# EAGLE schematic hodiny2_4beta (EAGLE 5.11)

## Sheet 1 of 2
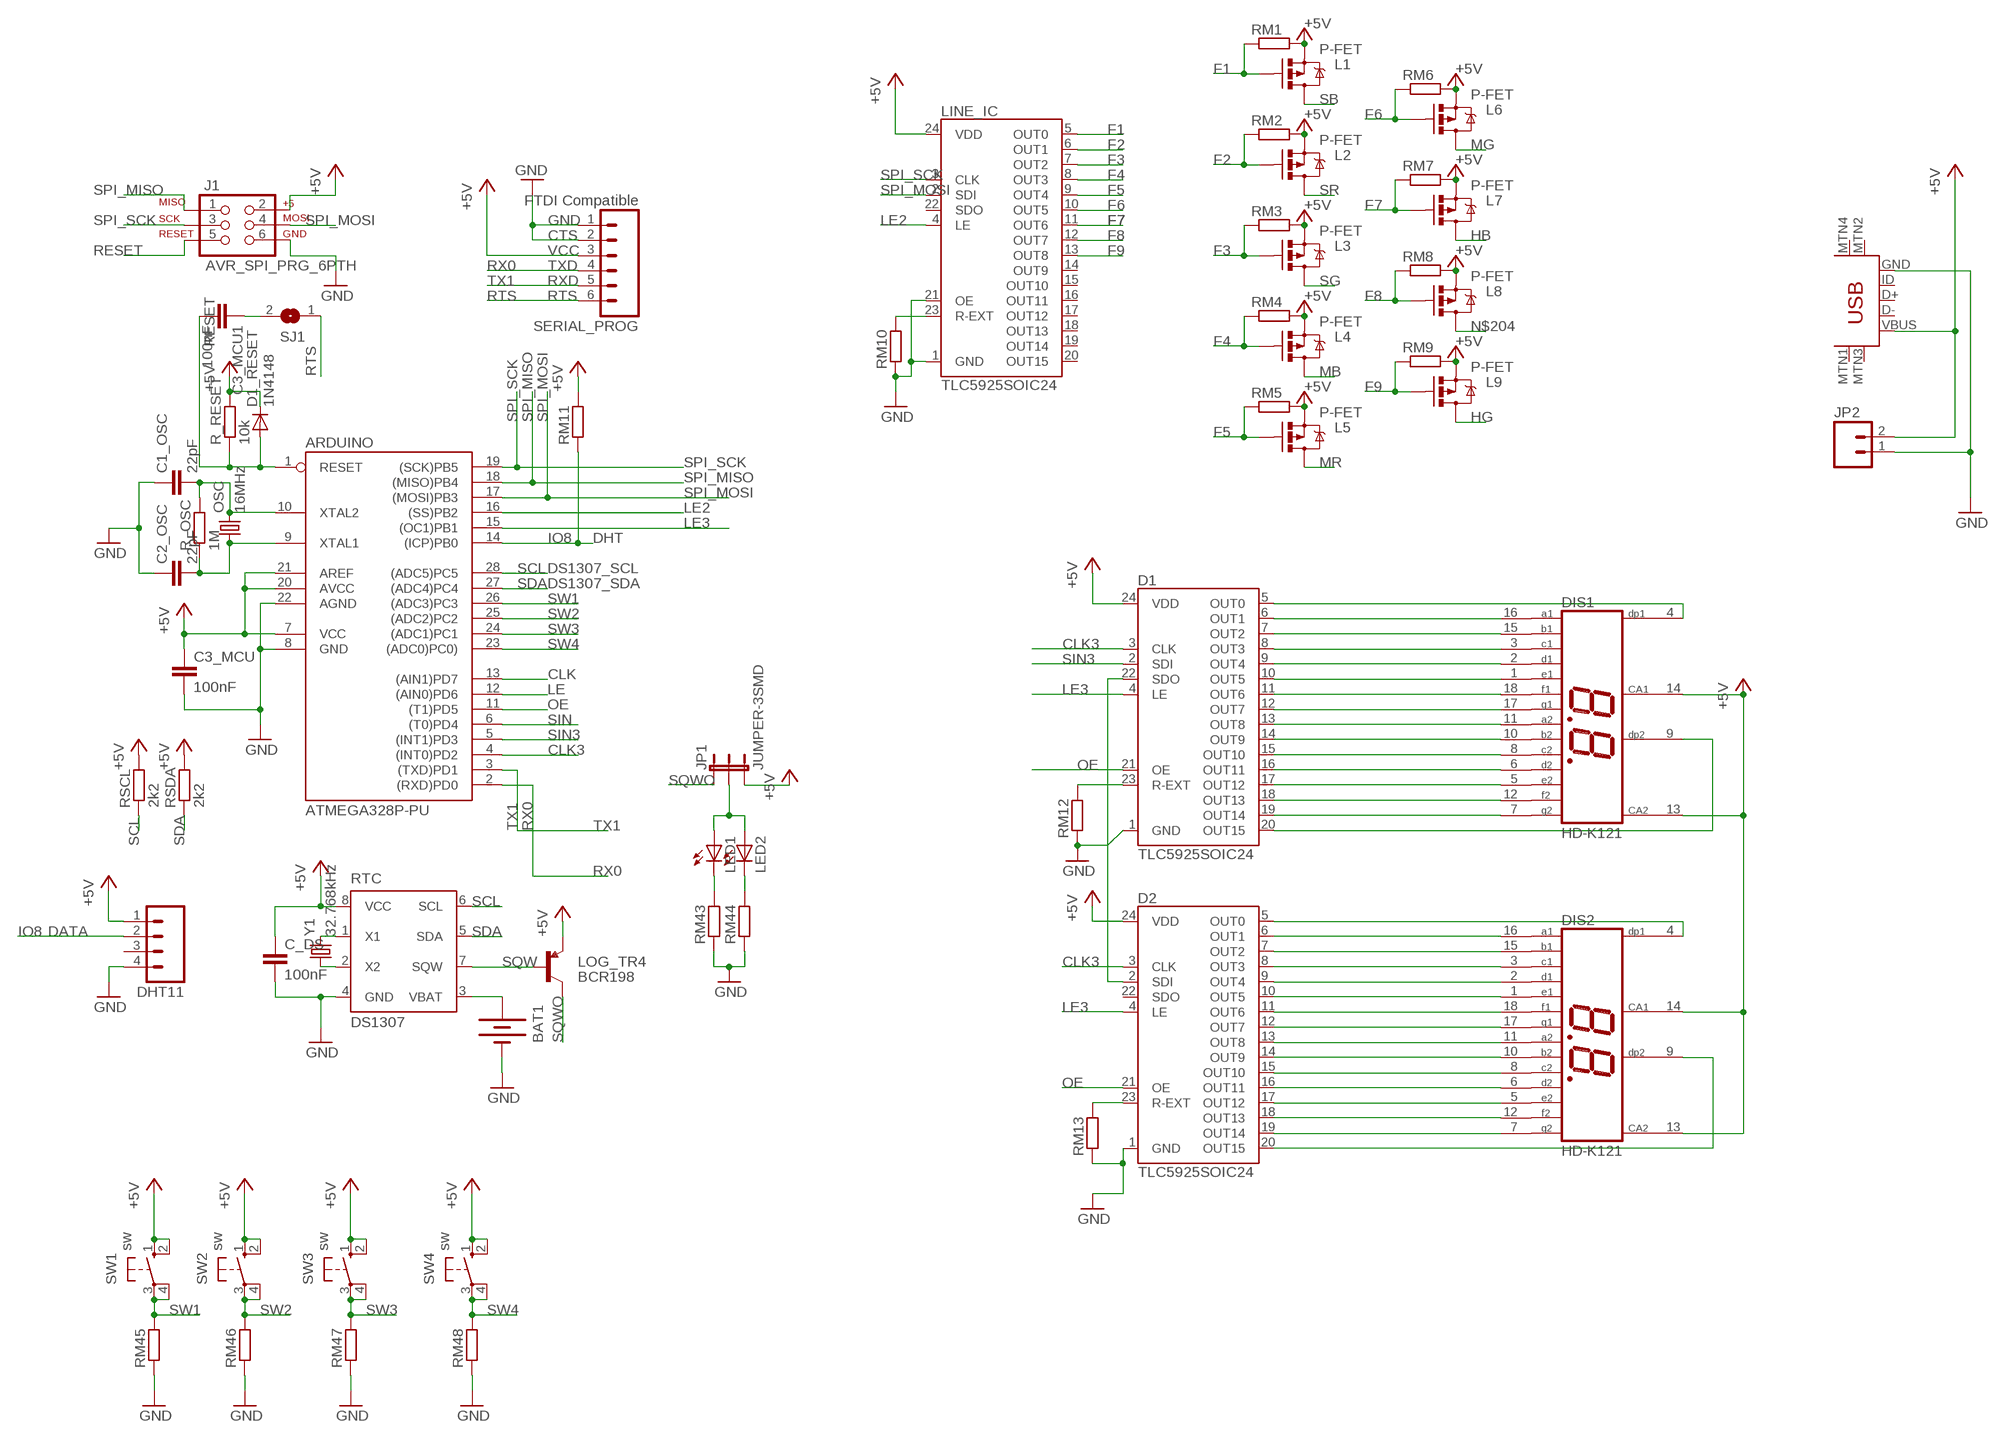
[diagram p0: schematic, sheet 1]

### Parts
ARDUINO  ATMEGA328P-PU  SMARTPRJ_ATMEGA328P-PU  [SMARTPRJ_DIL28-3]
BAT1  BATTERY12PTH  [BATTCON_12MM_PTH]
C1_OSC  22pF  CAP0603-CAP  [0603-CAP]
C2_OSC  22pF  CAP0603-CAP  [0603-CAP]
C3_MCU  100nF  C-EUC0805  [C0805]
C3_MCU1  100nF  C-EUC0805  [C0805]
C_DS  100nF  C-EUC0805  [C0805]
D1  TLC5925SOIC24  [SO24W]
D1_RESET  1N4148  1N4148DO35-7  [DO35-7]
D2  TLC5925SOIC24  [SO24W]
DHT11  M04PTH  [1X04]
DIS1  HD-K121  [HDSP-R]
DIS2  HD-K121  [HDSP-R]
J1  AVR_SPI_PRG_6PTH  [2X3]
JP1  JUMPER-3SMD  [SJ_3]
JP2  M025MM  [SCREWTERMINAL-5MM-2]
L1  P-FET  MOSFET-PCHANNELSMD  [SOT23-3]
L2  P-FET  MOSFET-PCHANNELSMD  [SOT23-3]
L3  P-FET  MOSFET-PCHANNELSMD  [SOT23-3]
L4  P-FET  MOSFET-PCHANNELSMD  [SOT23-3]
L5  P-FET  MOSFET-PCHANNELSMD  [SOT23-3]
L6  P-FET  MOSFET-PCHANNELSMD  [SOT23-3]
L7  P-FET  MOSFET-PCHANNELSMD  [SOT23-3]
L8  P-FET  MOSFET-PCHANNELSMD  [SOT23-3]
L9  P-FET  MOSFET-PCHANNELSMD  [SOT23-3]
LED1  LED_LED3MM  [LED_LED3MM]
LED2  LED_LED3MM  [LED_LED3MM]
LINE_IC  TLC5925SOIC24  [SO24W]
LOG_TR4  BCR198  TRANSISTOR_PNPSMD  [SOT23-3]
OSC  16MHz  CRYSTALHC49UP  [HC49UP]
R_OSC  1M  R-EU_0207/10  [0207/10]
R_RESET  10k  R-EU_0207/10  [0207/10]
RM1  R-EU_M0805  [M0805]
RM2  R-EU_M0805  [M0805]
RM3  R-EU_M0805  [M0805]
RM4  R-EU_M0805  [M0805]
RM5  R-EU_M0805  [M0805]
RM6  R-EU_M0805  [M0805]
RM7  R-EU_M0805  [M0805]
RM8  R-EU_M0805  [M0805]
RM9  R-EU_M0805  [M0805]
RM10  R-EU_M0805  [M0805]
RM11  R-EU_M0805  [M0805]
RM12  R-EU_M0805  [M0805]
RM13  R-EU_M0805  [M0805]
RM43  R-EU_M0805  [M0805]
RM44  R-EU_M0805  [M0805]
RM45  R-EU_M0805  [M0805]
RM46  R-EU_M0805  [M0805]
RM47  R-EU_M0805  [M0805]
RM48  R-EU_M0805  [M0805]
RSCL  2k2  SMARTPRJ_R-EU_M1206  [SMARTPRJ_M1206]
RSDA  2k2  SMARTPRJ_R-EU_M1206  [SMARTPRJ_M1206]
RTC  DS1307  [DIL08]
SERIAL_PROG  FTDI Compatible  M06LOCK  [1X06_LOCK]
SJ1  SJ  [SJ]
SW1  sw  11-XX  [B3F-11XX]
SW2  sw  11-XX  [B3F-11XX]
SW3  sw  11-XX  [B3F-11XX]
SW4  sw  11-XX  [B3F-11XX]
U$1  USB-MINIB-5PIN  [USB-MINIB]
Y1  32.768kHz  CRYSTALTC38H  [TC38H]

### Nets
+5V: ARDUINO.7(VCC) ARDUINO.20(AVCC) ARDUINO.21(AREF) C3_MCU.1 C_DS.1 D1.24(VDD) D1_RESET.C D2.24(VDD) DHT11.1 DIS1.13(CA2) DIS1.14(CA1) DIS2.13(CA2) DIS2.14(CA1) J1.2 JP1.3 JP2.2 L1.2(S) L2.2(S) L3.2(S) L4.2(S) L5.2(S) L6.2(S) L7.2(S) L8.2(S) L9.2(S) LINE_IC.24(VDD) LOG_TR4.2(E) R_RESET.2 RM1.2 RM2.2 RM3.2 RM4.2 RM5.2 RM6.2 RM7.2 RM8.2 RM9.2 RM11.2 RSCL.2 RSDA.2 RTC.8(VCC) SERIAL_PROG.3 SW1.1(S) SW1.2(S1) SW2.1(S) SW2.2(S1) SW3.1(S) SW3.2(S1) SW4.1(S) SW4.2(S1) U$1.VBUS ; also sheet 2
CLK: ARDUINO.13((AIN1)PD7) ; also sheet 2
CLK3: ARDUINO.4((INT0)PD2) D1.3(CLK) D2.3(CLK)
F1: L1.1(G) LINE_IC.5(OUT0) RM1.1
F2: L2.1(G) LINE_IC.6(OUT1) RM2.1
F3: L3.1(G) LINE_IC.7(OUT2) RM3.1
F4: L4.1(G) LINE_IC.8(OUT3) RM4.1
F5: L5.1(G) LINE_IC.9(OUT4) RM5.1
F6: L6.1(G) LINE_IC.10(OUT5) RM6.1
F7: L7.1(G) LINE_IC.11(OUT6) RM7.1
F8: L8.1(G) LINE_IC.12(OUT7) RM8.1
F9: L9.1(G) LINE_IC.13(OUT8) RM9.1
GND: ARDUINO.8(GND) ARDUINO.22(AGND) BAT1.GND(-) C1_OSC.1 C2_OSC.1 C3_MCU.2 C_DS.2 D1.1(GND) D2.1(GND) DHT11.4 J1.6 JP2.1 LINE_IC.1(GND) LINE_IC.21(OE) RM10.1 RM12.1 RM13.1 RM43.1 RM44.1 RM45.1 RM46.1 RM47.1 RM48.1 RTC.4(GND) SERIAL_PROG.1 SERIAL_PROG.2 U$1.GND ; also sheet 2
HB: L7.3(D) ; also sheet 2
HG: L9.3(D) ; also sheet 2
IO8: ARDUINO.14((ICP)PB0) DHT11.2 RM11.1
LE: ARDUINO.12((AIN0)PD6) ; also sheet 2
LE2: ARDUINO.16((SS)PB2) LINE_IC.4(LE)
LE3: ARDUINO.15((OC1)PB1) D1.4(LE) D2.4(LE)
MB: L4.3(D) ; also sheet 2
MG: L6.3(D) ; also sheet 2
MR: L5.3(D) ; also sheet 2
N$1: RTC.1(X1) Y1.2
N$2: RTC.2(X2) Y1.1
N$3: D1.5(OUT0) DIS1.4(DP1)
N$5: BAT1.VCC@1(+) RTC.3(VBAT)
N$11: ARDUINO.9(XTAL1) C2_OSC.2 OSC.1 R_OSC.1
N$13: ARDUINO.10(XTAL2) C1_OSC.2 OSC.2 R_OSC.2
N$14: C3_MCU1.1 SJ1.2
N$35: D1.20(OUT15) DIS1.9(DP2)
N$189: D1.19(OUT14) DIS1.7(G2)
N$190: D1.18(OUT13) DIS1.12(F2)
N$191: D1.17(OUT12) DIS1.5(E2)
N$192: D1.16(OUT11) DIS1.6(D2)
N$193: D1.15(OUT10) DIS1.8(C2)
N$194: D1.14(OUT9) DIS1.10(B2)
N$195: D1.13(OUT8) DIS1.11(A2)
N$196: D1.12(OUT7) DIS1.17(G1)
N$197: LINE_IC.23(R-EXT) RM10.2
N$198: D1.11(OUT6) DIS1.18(F1)
N$199: D1.10(OUT5) DIS1.1(E1)
N$200: D1.9(OUT4) DIS1.2(D1)
N$201: D1.8(OUT3) DIS1.3(C1)
N$202: D1.7(OUT2) DIS1.15(B1)
N$203: D1.6(OUT1) DIS1.16(A1)
N$204: L8.3(D) ; also sheet 2
N$205: D2.5(OUT0) DIS2.4(DP1)
N$206: D2.20(OUT15) DIS2.9(DP2)
N$207: D2.19(OUT14) DIS2.7(G2)
N$208: D2.18(OUT13) DIS2.12(F2)
N$209: D2.17(OUT12) DIS2.5(E2)
N$210: D2.16(OUT11) DIS2.6(D2)
N$211: D2.15(OUT10) DIS2.8(C2)
N$212: D2.14(OUT9) DIS2.10(B2)
N$213: D2.13(OUT8) DIS2.11(A2)
N$214: D2.12(OUT7) DIS2.17(G1)
N$215: D2.11(OUT6) DIS2.18(F1)
N$216: D2.10(OUT5) DIS2.1(E1)
N$217: D2.9(OUT4) DIS2.2(D1)
N$218: D2.8(OUT3) DIS2.3(C1)
N$219: D2.7(OUT2) DIS2.15(B1)
N$220: D2.6(OUT1) DIS2.16(A1)
N$221: D1.23(R-EXT) RM12.2
N$223: D2.23(R-EXT) RM13.2
N$225: D1.22(SDO) D2.2(SDI)
N$264: JP1.2 LED1.A LED2.A
N$265: LED1.K(C) RM43.2
N$266: LED2.K(C) RM44.2
OE: ARDUINO.11((T1)PD5) D1.21(OE) D2.21(OE) ; also sheet 2
RESET: ARDUINO.1(RESET) C3_MCU1.2 D1_RESET.A J1.5 R_RESET.1
RTS: SERIAL_PROG.6 SJ1.1
RX0: ARDUINO.2((RXD)PD0) SERIAL_PROG.4
SB: L1.3(D) ; also sheet 2
SCL: ARDUINO.28((ADC5)PC5) RSCL.1 RTC.6(SCL)
SDA: ARDUINO.27((ADC4)PC4) RSDA.1 RTC.5(SDA)
SG: L3.3(D) ; also sheet 2
SIN: ARDUINO.6((T0)PD4) ; also sheet 2
SIN3: ARDUINO.5((INT1)PD3) D1.2(SDI)
SPI_MISO: ARDUINO.18((MISO)PB4) J1.1
SPI_MOSI: ARDUINO.17((MOSI)PB3) J1.4 LINE_IC.2(SDI)
SPI_SCK: ARDUINO.19((SCK)PB5) J1.3 LINE_IC.3(CLK)
SQW: LOG_TR4.1(B) RTC.7(SQW)
SQWO: JP1.1 LOG_TR4.3(C)
SR: L2.3(D) ; also sheet 2
SW1: ARDUINO.26((ADC3)PC3) RM45.2 SW1.3(P) SW1.4(P1)
SW2: ARDUINO.25((ADC2)PC2) RM46.2 SW2.3(P) SW2.4(P1)
SW3: ARDUINO.24((ADC1)PC1) RM47.2 SW3.3(P) SW3.4(P1)
SW4: ARDUINO.23((ADC0)PC0)) RM48.2 SW4.3(P) SW4.4(P1)
TX1: ARDUINO.3((TXD)PD1) SERIAL_PROG.5
Unconnected: D2.22(SDO) DHT11.3 LINE_IC.14(OUT9) LINE_IC.15(OUT10) LINE_IC.16(OUT11) LINE_IC.17(OUT12) LINE_IC.18(OUT13) LINE_IC.19(OUT14) LINE_IC.20(OUT15) LINE_IC.22(SDO) U$1.D+ U$1.D- U$1.ID U$1.MTN1(MTN2) U$1.MTN2(MTN3) U$1.MTN3(MTN1) U$1.MTN4

### Notes on the sheet
- GND
- CTS
- VCC
- TXD
- RXD
- RTS
- DHT
- DS1307_SCL
- DS1307_SDA
- DATA

## Sheet 2 of 2
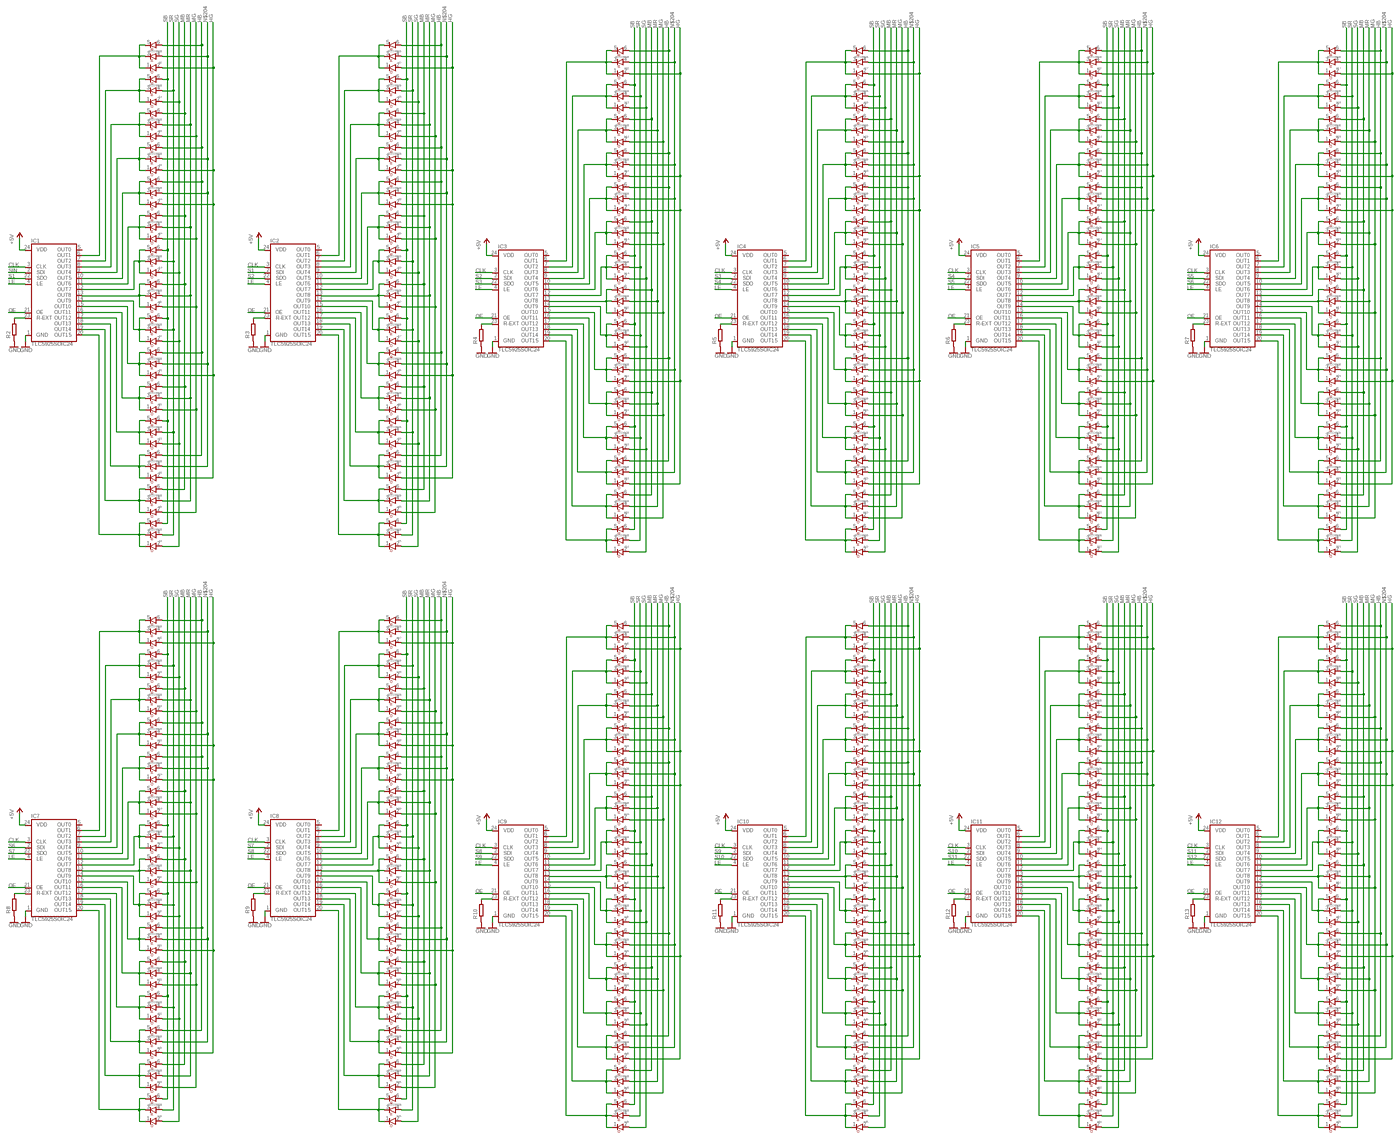
[diagram p1: schematic, sheet 2, overview]
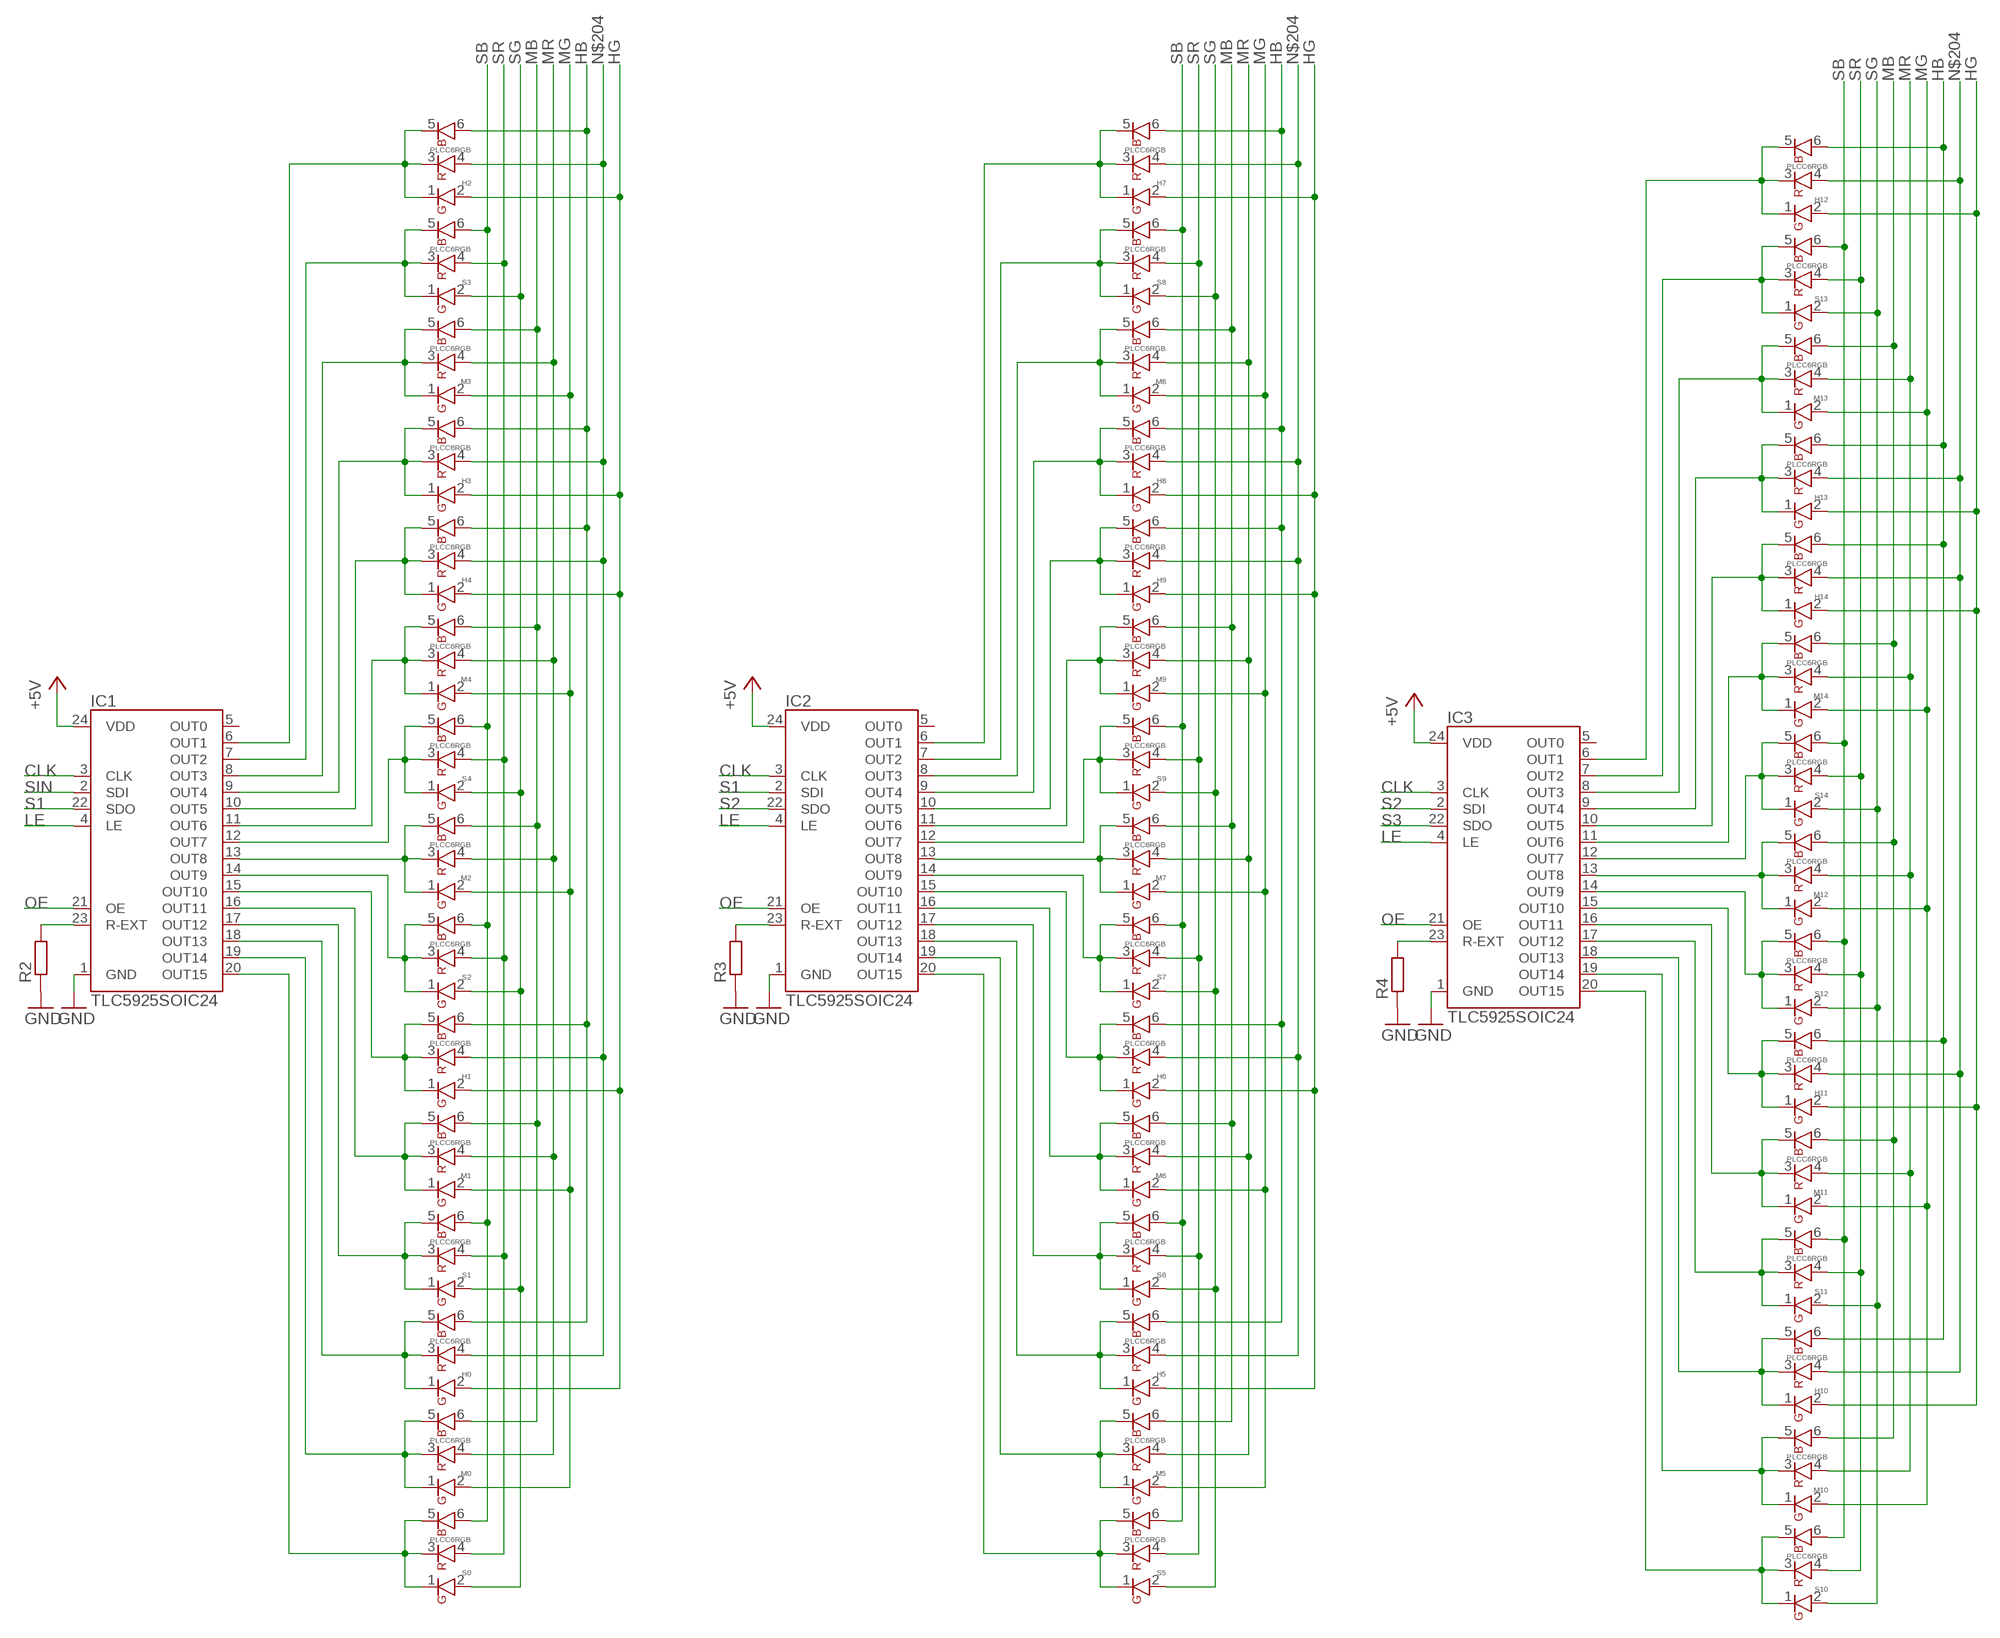
[diagram p2: schematic, sheet 2, part 1 of 4]
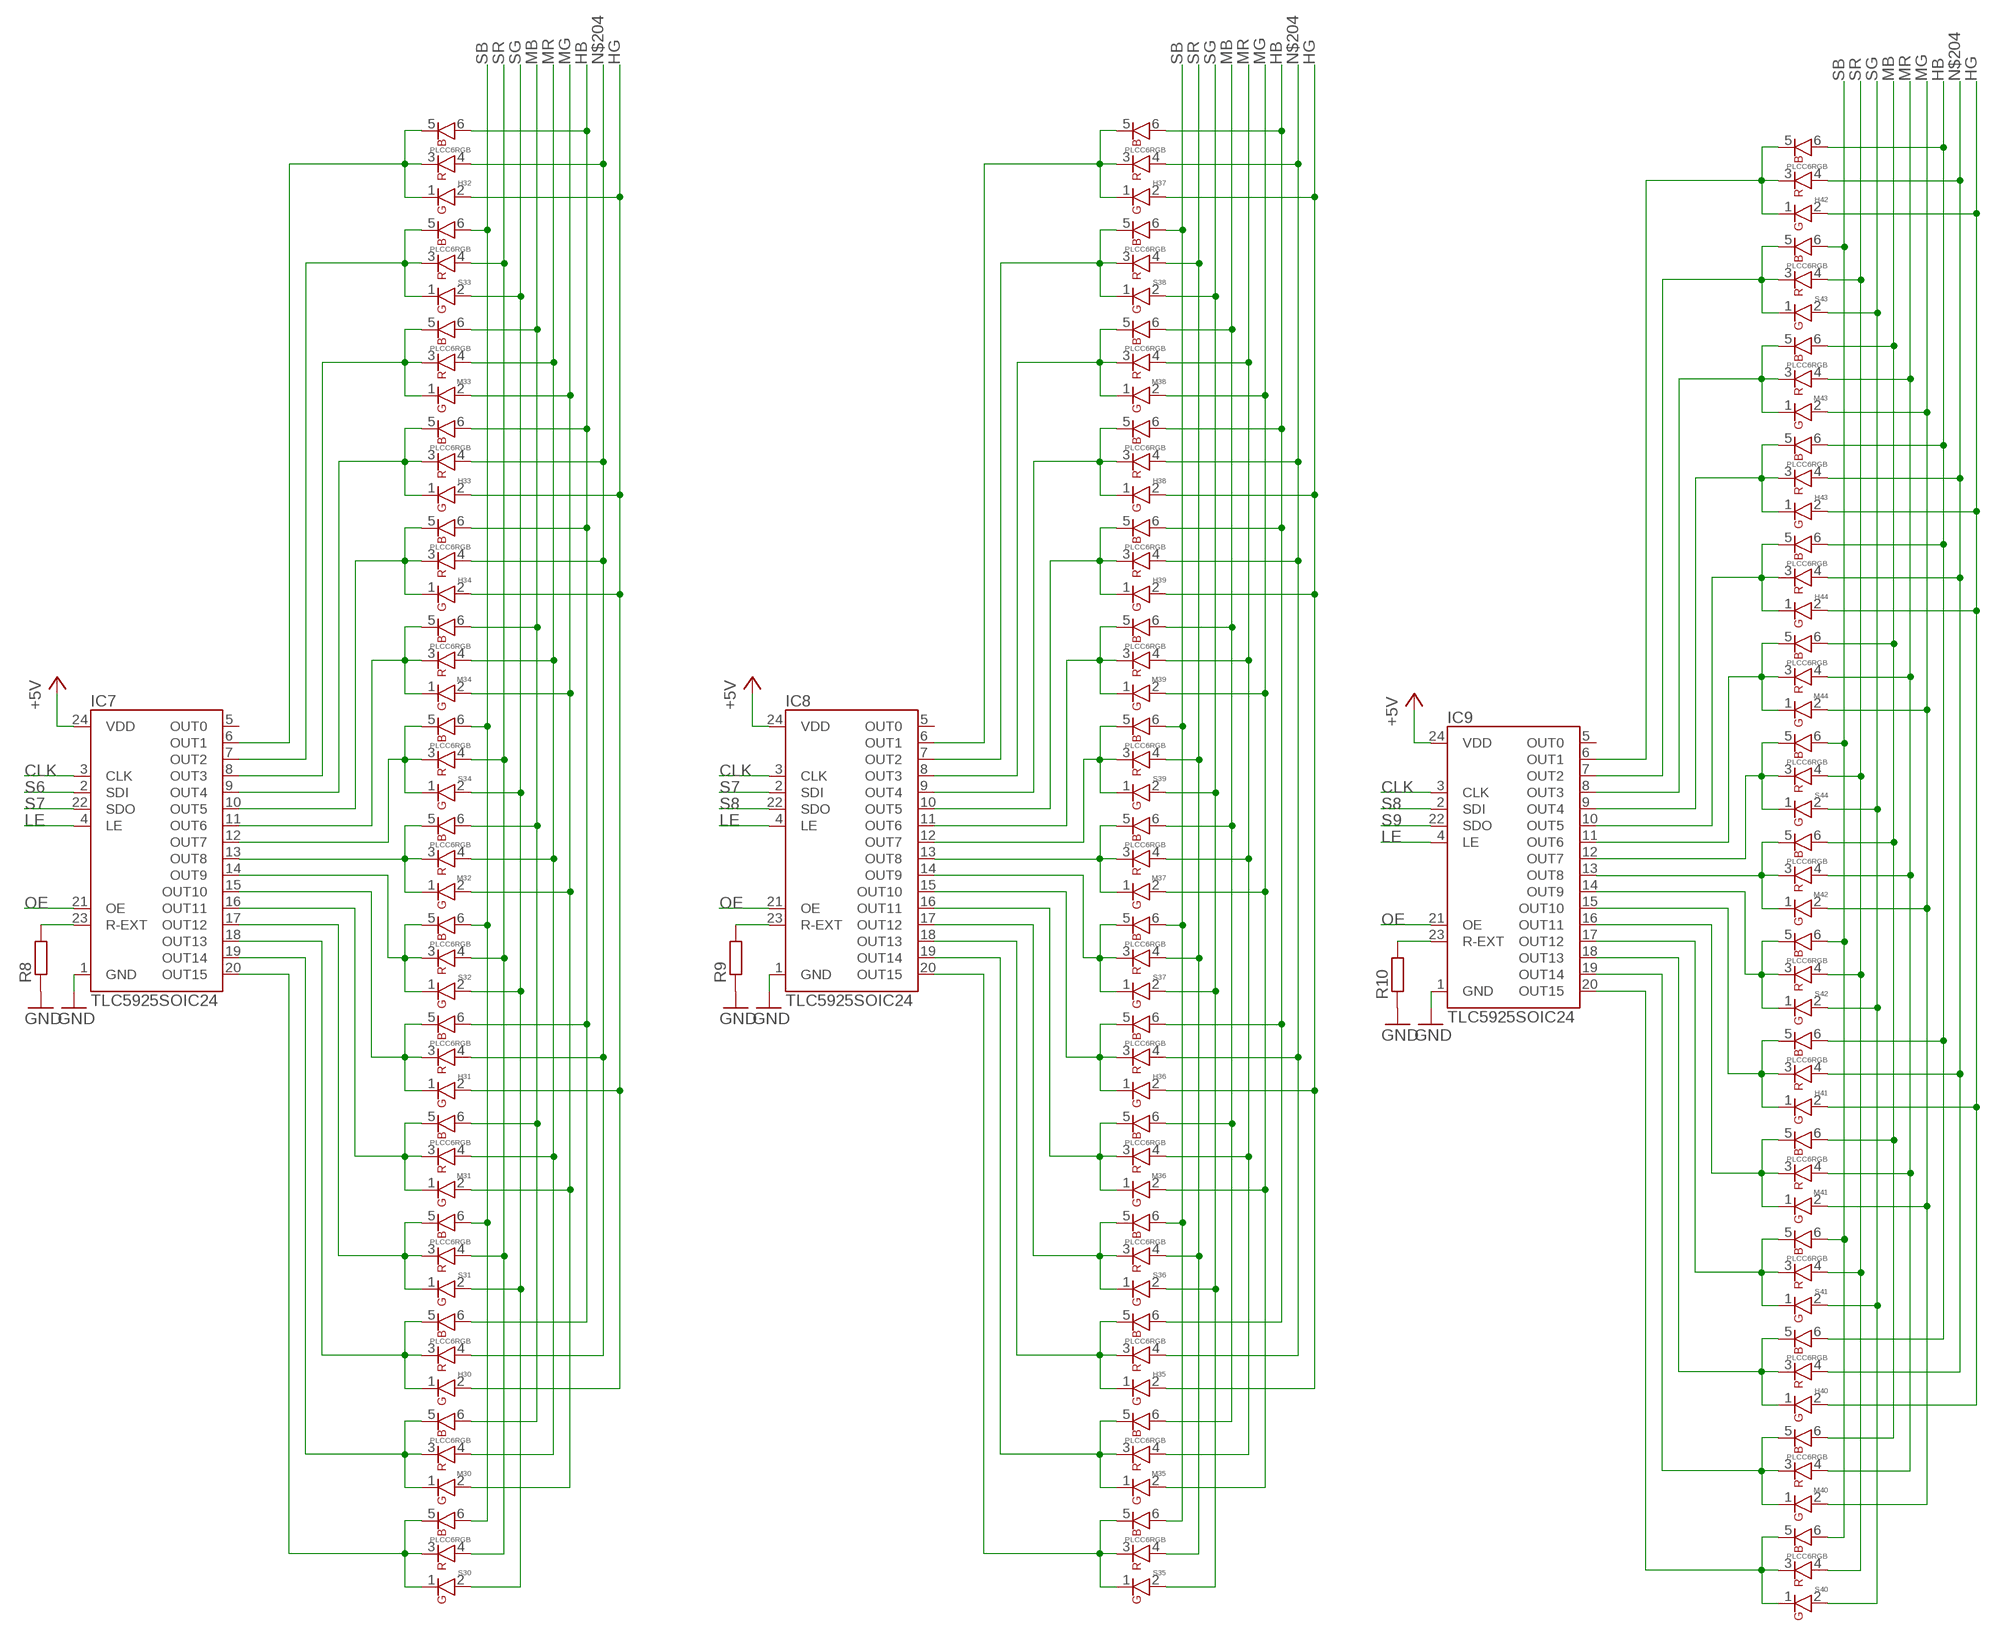
[diagram p3: schematic, sheet 2, part 2 of 4]
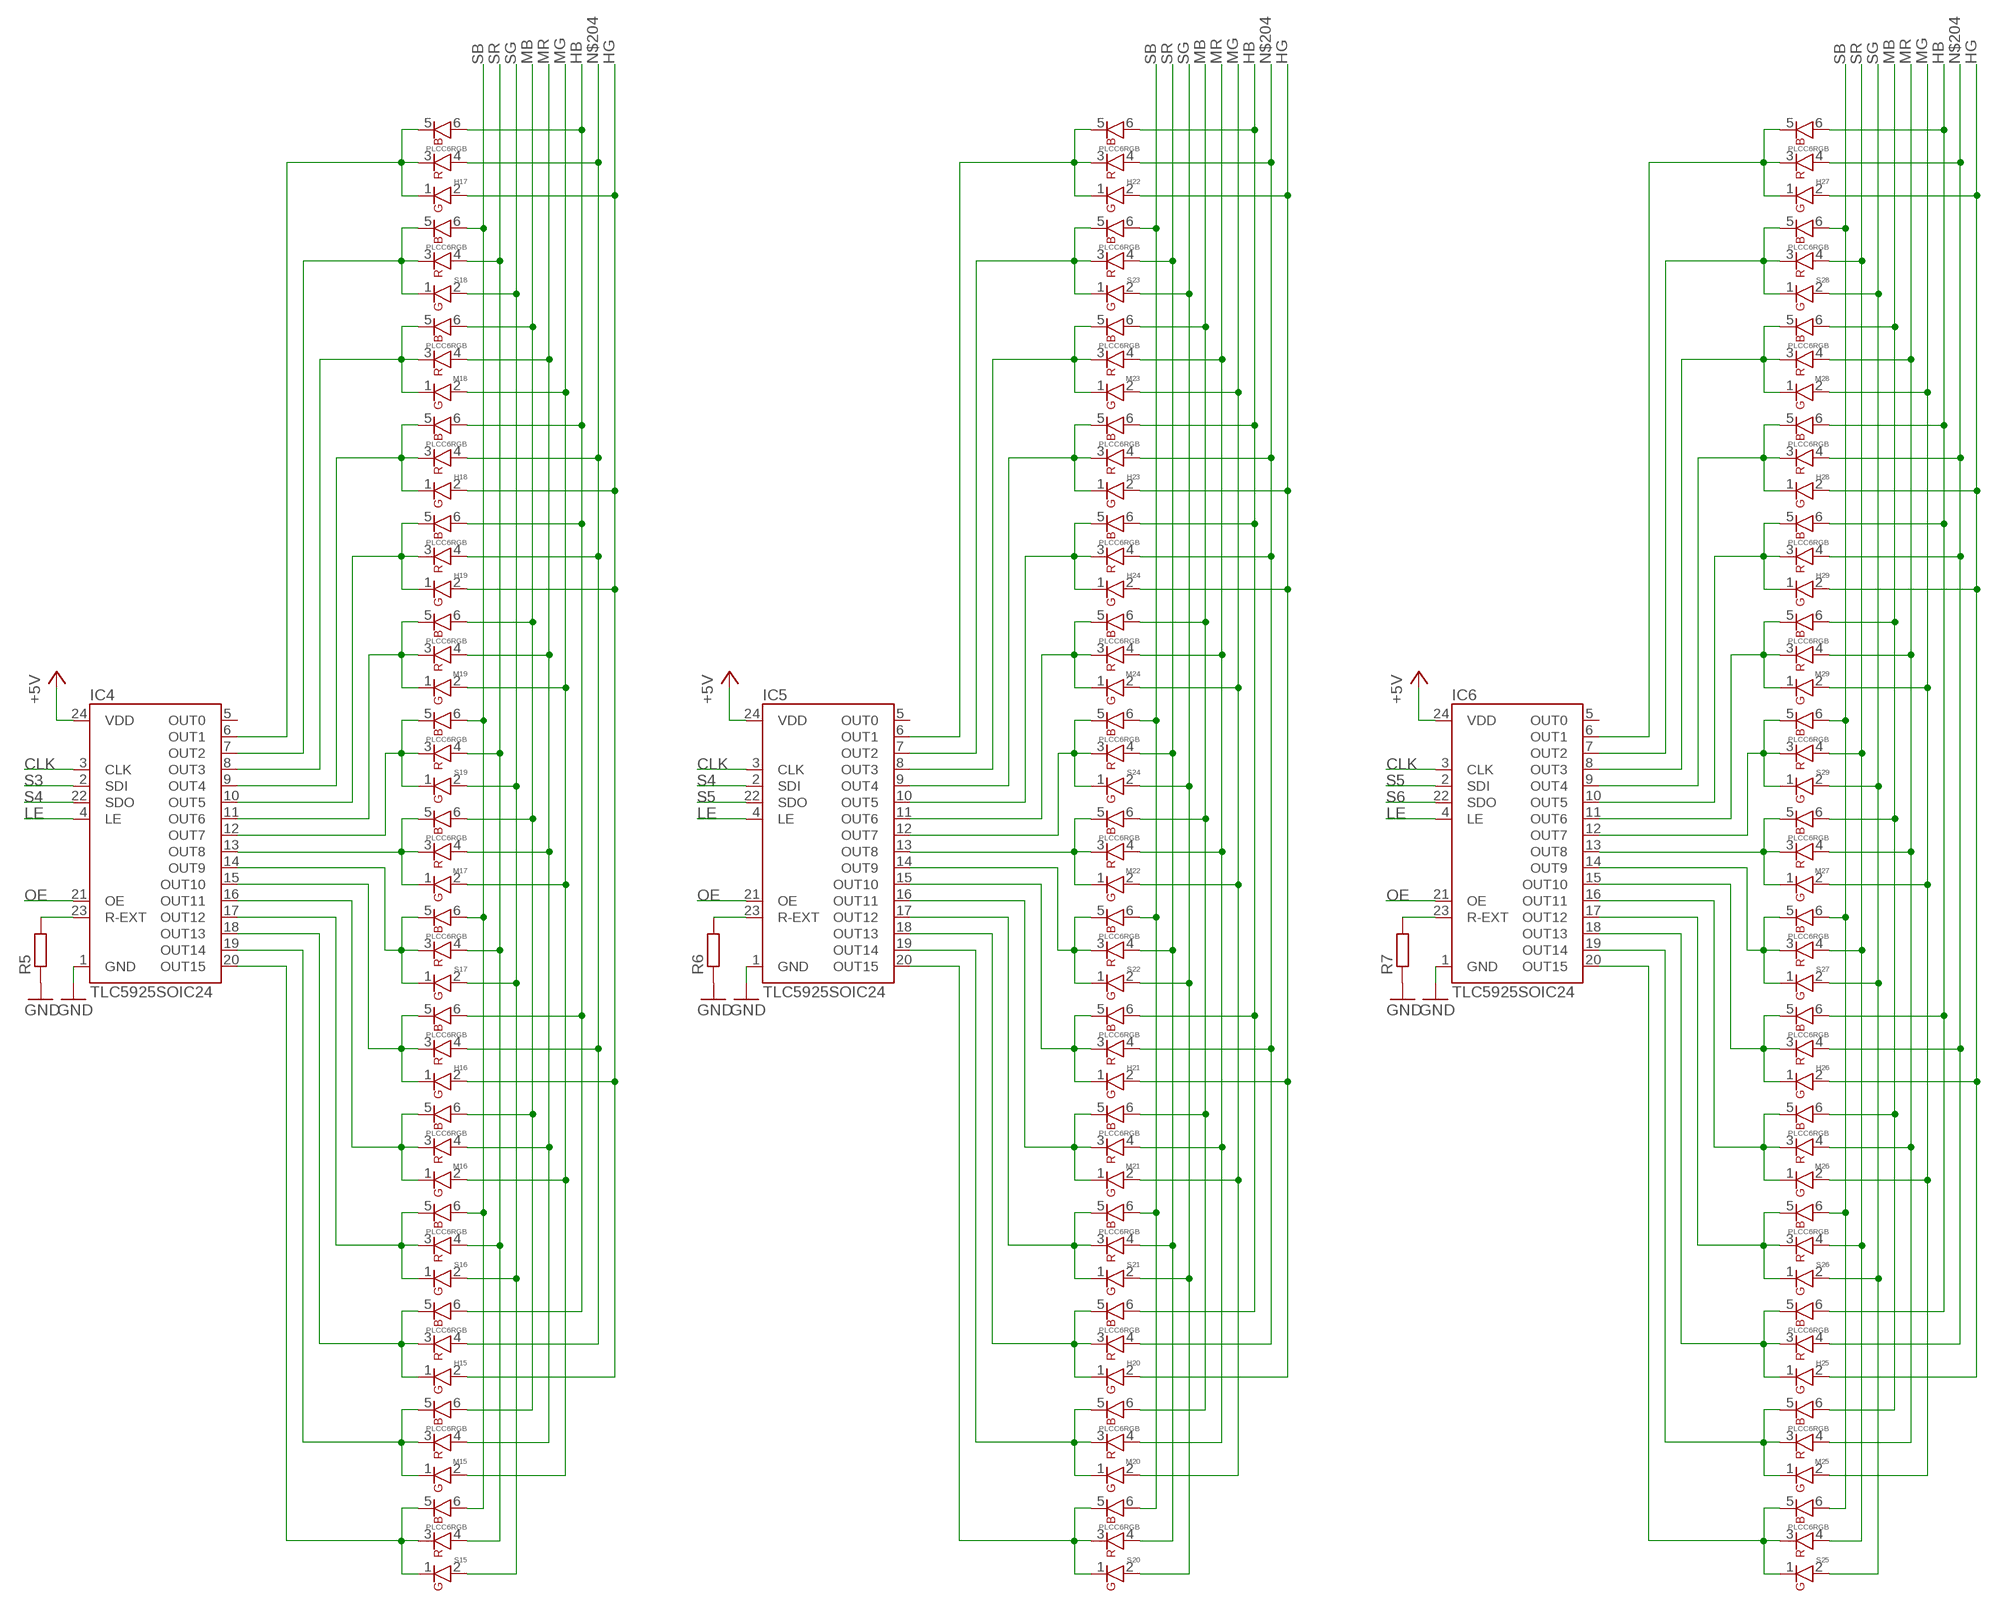
[diagram p4: schematic, sheet 2, part 3 of 4]
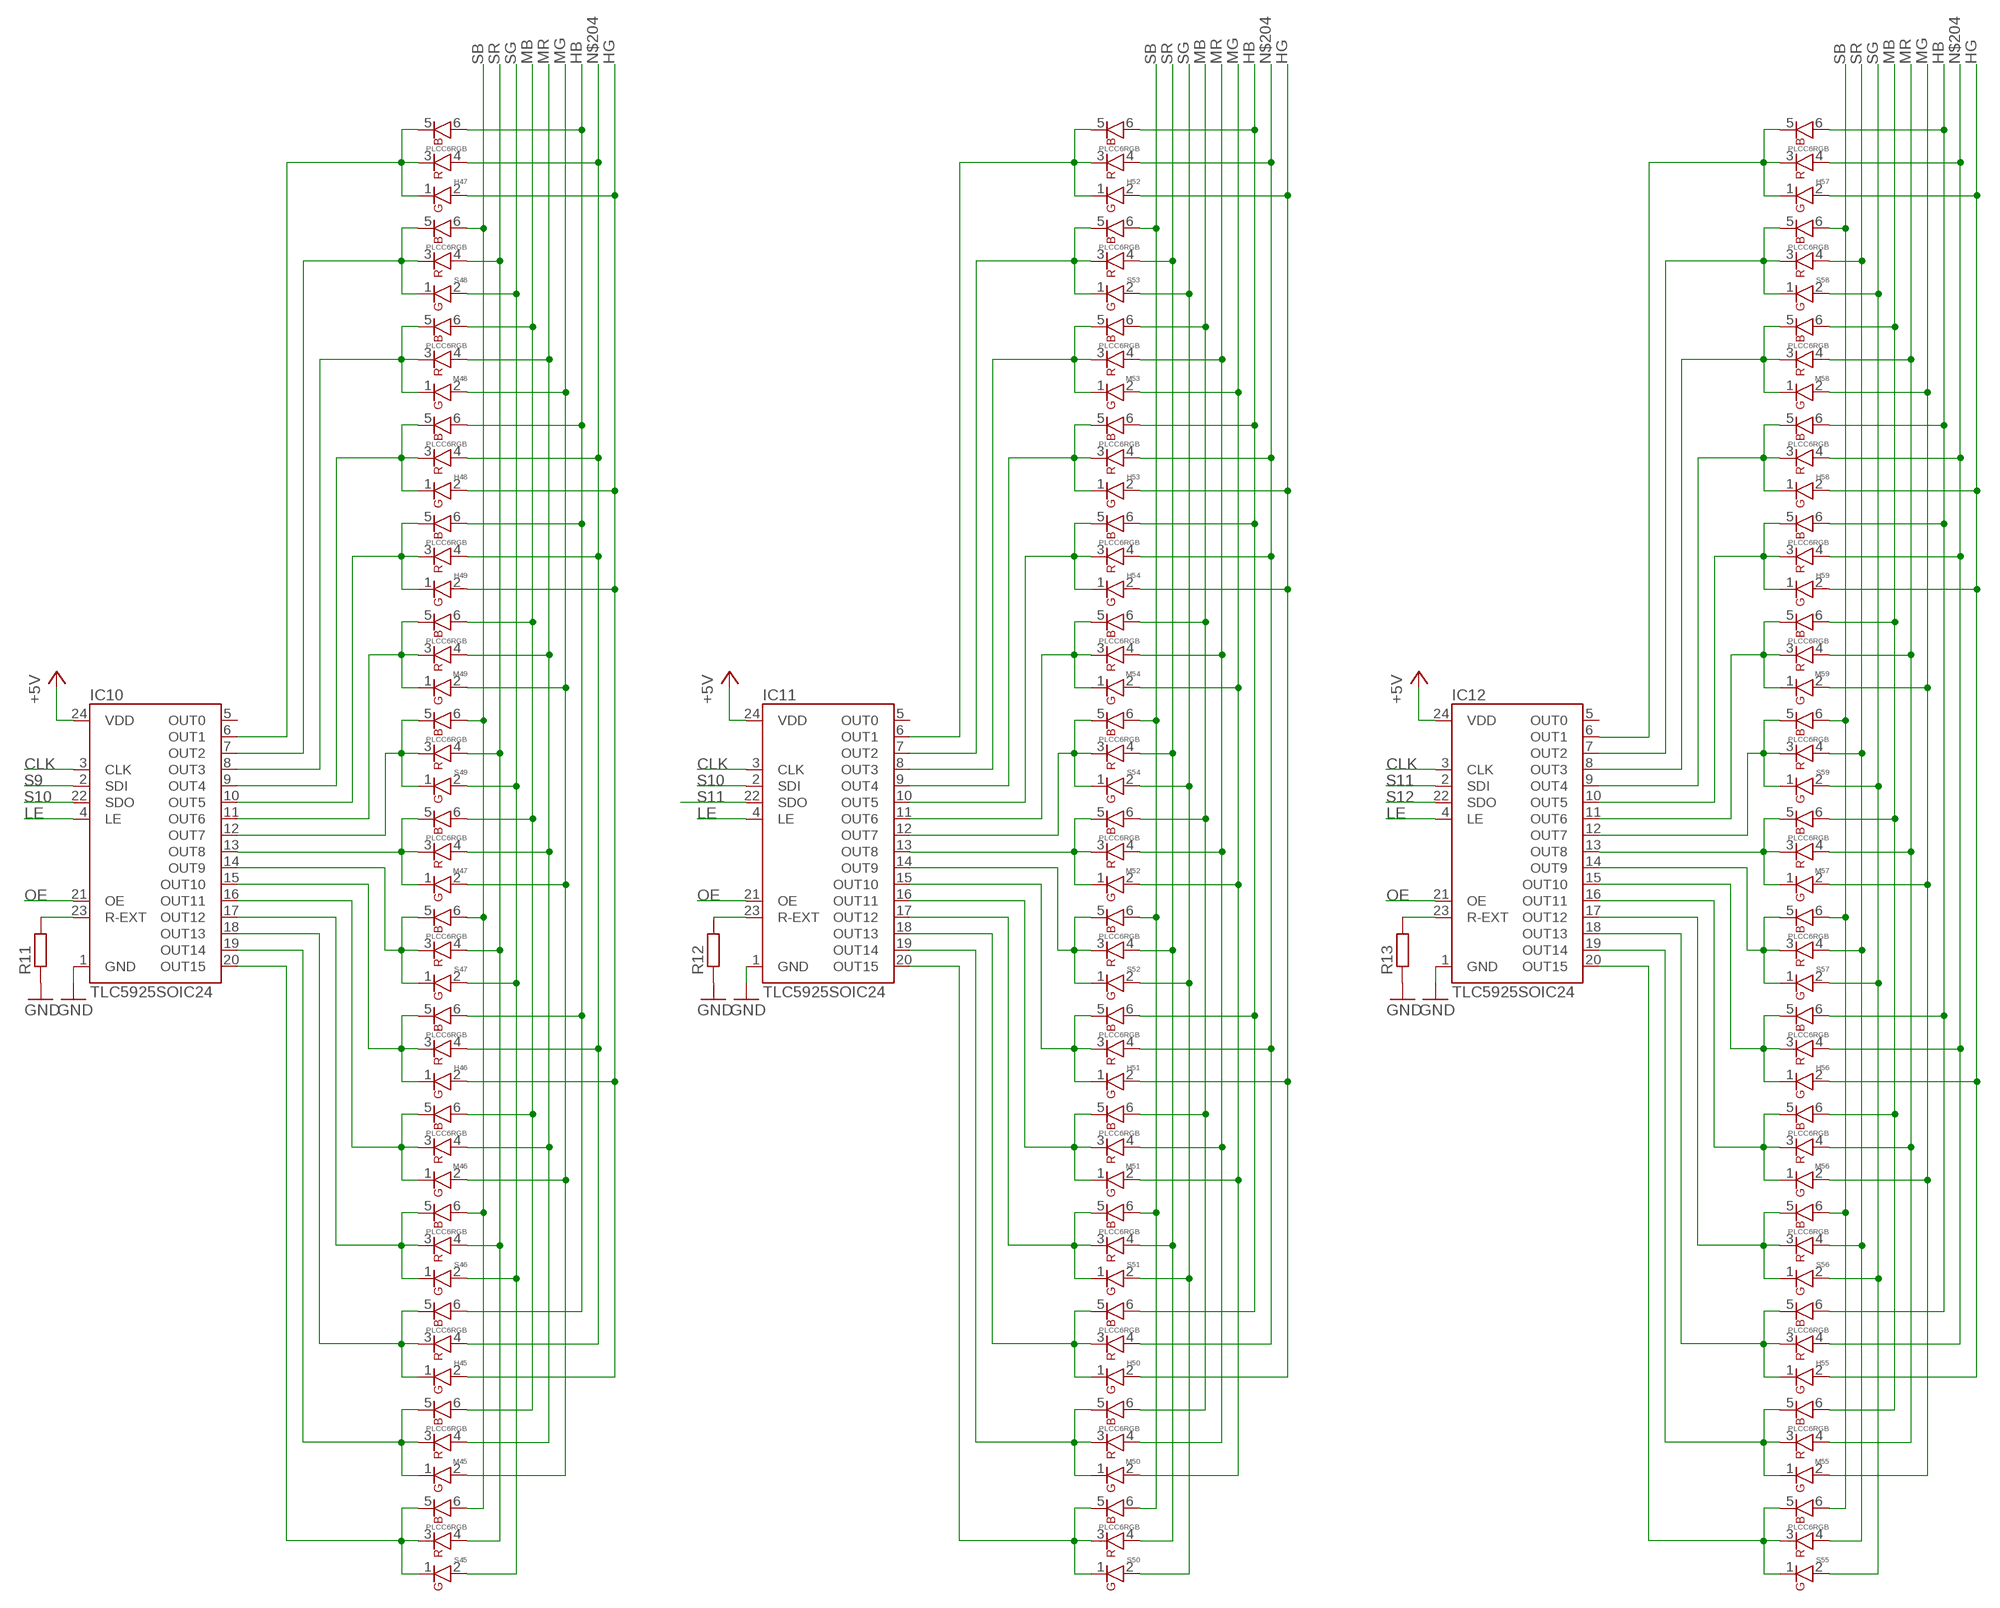
[diagram p5: schematic, sheet 2, part 4 of 4]

### Parts
H0  PLCC6RGB  [PLCC6]
H1  PLCC6RGB  [PLCC6]
H2  PLCC6RGB  [PLCC6]
H3  PLCC6RGB  [PLCC6]
H4  PLCC6RGB  [PLCC6]
H5  PLCC6RGB  [PLCC6]
H6  PLCC6RGB  [PLCC6]
H7  PLCC6RGB  [PLCC6]
H8  PLCC6RGB  [PLCC6]
H9  PLCC6RGB  [PLCC6]
H10  PLCC6RGB  [PLCC6]
H11  PLCC6RGB  [PLCC6]
H12  PLCC6RGB  [PLCC6]
H13  PLCC6RGB  [PLCC6]
H14  PLCC6RGB  [PLCC6]
H15  PLCC6RGB  [PLCC6]
H16  PLCC6RGB  [PLCC6]
H17  PLCC6RGB  [PLCC6]
H18  PLCC6RGB  [PLCC6]
H19  PLCC6RGB  [PLCC6]
H20  PLCC6RGB  [PLCC6]
H21  PLCC6RGB  [PLCC6]
H22  PLCC6RGB  [PLCC6]
H23  PLCC6RGB  [PLCC6]
H24  PLCC6RGB  [PLCC6]
H25  PLCC6RGB  [PLCC6]
H26  PLCC6RGB  [PLCC6]
H27  PLCC6RGB  [PLCC6]
H28  PLCC6RGB  [PLCC6]
H29  PLCC6RGB  [PLCC6]
H30  PLCC6RGB  [PLCC6]
H31  PLCC6RGB  [PLCC6]
H32  PLCC6RGB  [PLCC6]
H33  PLCC6RGB  [PLCC6]
H34  PLCC6RGB  [PLCC6]
H35  PLCC6RGB  [PLCC6]
H36  PLCC6RGB  [PLCC6]
H37  PLCC6RGB  [PLCC6]
H38  PLCC6RGB  [PLCC6]
H39  PLCC6RGB  [PLCC6]
H40  PLCC6RGB  [PLCC6]
H41  PLCC6RGB  [PLCC6]
H42  PLCC6RGB  [PLCC6]
H43  PLCC6RGB  [PLCC6]
H44  PLCC6RGB  [PLCC6]
H45  PLCC6RGB  [PLCC6]
H46  PLCC6RGB  [PLCC6]
H47  PLCC6RGB  [PLCC6]
H48  PLCC6RGB  [PLCC6]
H49  PLCC6RGB  [PLCC6]
H50  PLCC6RGB  [PLCC6]
H51  PLCC6RGB  [PLCC6]
H52  PLCC6RGB  [PLCC6]
H53  PLCC6RGB  [PLCC6]
H54  PLCC6RGB  [PLCC6]
H55  PLCC6RGB  [PLCC6]
H56  PLCC6RGB  [PLCC6]
H57  PLCC6RGB  [PLCC6]
H58  PLCC6RGB  [PLCC6]
H59  PLCC6RGB  [PLCC6]
IC1  TLC5925SOIC24  [SO24W]
IC2  TLC5925SOIC24  [SO24W]
IC3  TLC5925SOIC24  [SO24W]
IC4  TLC5925SOIC24  [SO24W]
IC5  TLC5925SOIC24  [SO24W]
IC6  TLC5925SOIC24  [SO24W]
IC7  TLC5925SOIC24  [SO24W]
IC8  TLC5925SOIC24  [SO24W]
IC9  TLC5925SOIC24  [SO24W]
IC10  TLC5925SOIC24  [SO24W]
IC11  TLC5925SOIC24  [SO24W]
IC12  TLC5925SOIC24  [SO24W]
M0  PLCC6RGB  [PLCC6]
M1  PLCC6RGB  [PLCC6]
M2  PLCC6RGB  [PLCC6]
M3  PLCC6RGB  [PLCC6]
M4  PLCC6RGB  [PLCC6]
M5  PLCC6RGB  [PLCC6]
M6  PLCC6RGB  [PLCC6]
M7  PLCC6RGB  [PLCC6]
M8  PLCC6RGB  [PLCC6]
M9  PLCC6RGB  [PLCC6]
M10  PLCC6RGB  [PLCC6]
M11  PLCC6RGB  [PLCC6]
M12  PLCC6RGB  [PLCC6]
M13  PLCC6RGB  [PLCC6]
M14  PLCC6RGB  [PLCC6]
M15  PLCC6RGB  [PLCC6]
M16  PLCC6RGB  [PLCC6]
M17  PLCC6RGB  [PLCC6]
M18  PLCC6RGB  [PLCC6]
M19  PLCC6RGB  [PLCC6]
M20  PLCC6RGB  [PLCC6]
M21  PLCC6RGB  [PLCC6]
M22  PLCC6RGB  [PLCC6]
M23  PLCC6RGB  [PLCC6]
M24  PLCC6RGB  [PLCC6]
M25  PLCC6RGB  [PLCC6]
M26  PLCC6RGB  [PLCC6]
M27  PLCC6RGB  [PLCC6]
M28  PLCC6RGB  [PLCC6]
M29  PLCC6RGB  [PLCC6]
M30  PLCC6RGB  [PLCC6]
M31  PLCC6RGB  [PLCC6]
M32  PLCC6RGB  [PLCC6]
M33  PLCC6RGB  [PLCC6]
M34  PLCC6RGB  [PLCC6]
M35  PLCC6RGB  [PLCC6]
M36  PLCC6RGB  [PLCC6]
M37  PLCC6RGB  [PLCC6]
M38  PLCC6RGB  [PLCC6]
M39  PLCC6RGB  [PLCC6]
M40  PLCC6RGB  [PLCC6]
M41  PLCC6RGB  [PLCC6]
M42  PLCC6RGB  [PLCC6]
M43  PLCC6RGB  [PLCC6]
M44  PLCC6RGB  [PLCC6]
M45  PLCC6RGB  [PLCC6]
M46  PLCC6RGB  [PLCC6]
M47  PLCC6RGB  [PLCC6]
M48  PLCC6RGB  [PLCC6]
M49  PLCC6RGB  [PLCC6]
M50  PLCC6RGB  [PLCC6]
M51  PLCC6RGB  [PLCC6]
M52  PLCC6RGB  [PLCC6]
M53  PLCC6RGB  [PLCC6]
M54  PLCC6RGB  [PLCC6]
M55  PLCC6RGB  [PLCC6]
M56  PLCC6RGB  [PLCC6]
M57  PLCC6RGB  [PLCC6]
M58  PLCC6RGB  [PLCC6]
M59  PLCC6RGB  [PLCC6]
R2  R-EU_M0805  [M0805]
R3  R-EU_M0805  [M0805]
R4  R-EU_M0805  [M0805]
R5  R-EU_M0805  [M0805]
R6  R-EU_M0805  [M0805]
R7  R-EU_M0805  [M0805]
R8  R-EU_M0805  [M0805]
R9  R-EU_M0805  [M0805]
R10  R-EU_M0805  [M0805]
R11  R-EU_M0805  [M0805]
R12  R-EU_M0805  [M0805]
R13  R-EU_M0805  [M0805]
S0  PLCC6RGB  [PLCC6]
S1  PLCC6RGB  [PLCC6]
S2  PLCC6RGB  [PLCC6]
S3  PLCC6RGB  [PLCC6]
S4  PLCC6RGB  [PLCC6]
S5  PLCC6RGB  [PLCC6]
S6  PLCC6RGB  [PLCC6]
S7  PLCC6RGB  [PLCC6]
S8  PLCC6RGB  [PLCC6]
S9  PLCC6RGB  [PLCC6]
S10  PLCC6RGB  [PLCC6]
S11  PLCC6RGB  [PLCC6]
S12  PLCC6RGB  [PLCC6]
S13  PLCC6RGB  [PLCC6]
S14  PLCC6RGB  [PLCC6]
S15  PLCC6RGB  [PLCC6]
S16  PLCC6RGB  [PLCC6]
S17  PLCC6RGB  [PLCC6]
S18  PLCC6RGB  [PLCC6]
S19  PLCC6RGB  [PLCC6]
S20  PLCC6RGB  [PLCC6]
S21  PLCC6RGB  [PLCC6]
S22  PLCC6RGB  [PLCC6]
S23  PLCC6RGB  [PLCC6]
S24  PLCC6RGB  [PLCC6]
S25  PLCC6RGB  [PLCC6]
S26  PLCC6RGB  [PLCC6]
S27  PLCC6RGB  [PLCC6]
S28  PLCC6RGB  [PLCC6]
S29  PLCC6RGB  [PLCC6]
S30  PLCC6RGB  [PLCC6]
S31  PLCC6RGB  [PLCC6]
S32  PLCC6RGB  [PLCC6]
S33  PLCC6RGB  [PLCC6]
S34  PLCC6RGB  [PLCC6]
S35  PLCC6RGB  [PLCC6]
S36  PLCC6RGB  [PLCC6]
S37  PLCC6RGB  [PLCC6]
S38  PLCC6RGB  [PLCC6]
S39  PLCC6RGB  [PLCC6]
S40  PLCC6RGB  [PLCC6]
S41  PLCC6RGB  [PLCC6]
S42  PLCC6RGB  [PLCC6]
S43  PLCC6RGB  [PLCC6]
S44  PLCC6RGB  [PLCC6]
S45  PLCC6RGB  [PLCC6]
S46  PLCC6RGB  [PLCC6]
S47  PLCC6RGB  [PLCC6]
S48  PLCC6RGB  [PLCC6]
S49  PLCC6RGB  [PLCC6]
S50  PLCC6RGB  [PLCC6]
S51  PLCC6RGB  [PLCC6]
S52  PLCC6RGB  [PLCC6]
S53  PLCC6RGB  [PLCC6]
S54  PLCC6RGB  [PLCC6]
S55  PLCC6RGB  [PLCC6]
S56  PLCC6RGB  [PLCC6]
S57  PLCC6RGB  [PLCC6]
S58  PLCC6RGB  [PLCC6]
S59  PLCC6RGB  [PLCC6]

### Nets
+5V: IC1.24(VDD) IC2.24(VDD) IC3.24(VDD) IC4.24(VDD) IC5.24(VDD) IC6.24(VDD) IC7.24(VDD) IC8.24(VDD) IC9.24(VDD) IC10.24(VDD) IC11.24(VDD) IC12.24(VDD) ; also sheet 1
CLK: IC1.3(CLK) IC2.3(CLK) IC3.3(CLK) IC4.3(CLK) IC5.3(CLK) IC6.3(CLK) IC7.3(CLK) IC8.3(CLK) IC9.3(CLK) IC10.3(CLK) IC11.3(CLK) IC12.3(CLK) ; also sheet 1
GND: IC1.1(GND) IC2.1(GND) IC3.1(GND) IC4.1(GND) IC5.1(GND) IC6.1(GND) IC7.1(GND) IC8.1(GND) IC9.1(GND) IC10.1(GND) IC11.1(GND) IC12.1(GND) R2.1 R3.1 R4.1 R5.1 R6.1 R7.1 R8.1 R9.1 R10.1 R11.1 R12.1 R13.1 ; also sheet 1
H1: H1.1(GC) H1.3(RC) H1.5(BC) IC1.15(OUT10)
H2: H6.1(GC) H6.3(RC) H6.5(BC) IC2.15(OUT10)
H3: H11.1(GC) H11.3(RC) H11.5(BC) IC3.15(OUT10)
H4: H16.1(GC) H16.3(RC) H16.5(BC) IC4.15(OUT10)
H5: H21.1(GC) H21.3(RC) H21.5(BC) IC5.15(OUT10)
H6: H26.1(GC) H26.3(RC) H26.5(BC) IC6.15(OUT10)
H7: H31.1(GC) H31.3(RC) H31.5(BC) IC7.15(OUT10)
H8: H36.1(GC) H36.3(RC) H36.5(BC) IC8.15(OUT10)
H9: H41.1(GC) H41.3(RC) H41.5(BC) IC9.15(OUT10)
H10: H46.1(GC) H46.3(RC) H46.5(BC) IC10.15(OUT10)
H11: H51.1(GC) H51.3(RC) H51.5(BC) IC11.15(OUT10)
H12: H56.1(GC) H56.3(RC) H56.5(BC) IC12.15(OUT10)
HB: H0.6(BA) H1.6(BA) H2.6(BA) H3.6(BA) H4.6(BA) H5.6(BA) H6.6(BA) H7.6(BA) H8.6(BA) H9.6(BA) H10.6(BA) H11.6(BA) H12.6(BA) H13.6(BA) H14.6(BA) H15.6(BA) H16.6(BA) H17.6(BA) H18.6(BA) H19.6(BA) H20.6(BA) H21.6(BA) H22.6(BA) H23.6(BA) H24.6(BA) H25.6(BA) H26.6(BA) H27.6(BA) H28.6(BA) H29.6(BA) H30.6(BA) H31.6(BA) H32.6(BA) H33.6(BA) H34.6(BA) H35.6(BA) H36.6(BA) H37.6(BA) H38.6(BA) H39.6(BA) H40.6(BA) H41.6(BA) H42.6(BA) H43.6(BA) H44.6(BA) H45.6(BA) H46.6(BA) H47.6(BA) H48.6(BA) H49.6(BA) H50.6(BA) H51.6(BA) H52.6(BA) H53.6(BA) H54.6(BA) H55.6(BA) H56.6(BA) H57.6(BA) H58.6(BA) H59.6(BA) ; also sheet 1
HG: H0.2(GA) H1.2(GA) H2.2(GA) H3.2(GA) H4.2(GA) H5.2(GA) H6.2(GA) H7.2(GA) H8.2(GA) H9.2(GA) H10.2(GA) H11.2(GA) H12.2(GA) H13.2(GA) H14.2(GA) H15.2(GA) H16.2(GA) H17.2(GA) H18.2(GA) H19.2(GA) H20.2(GA) H21.2(GA) H22.2(GA) H23.2(GA) H24.2(GA) H25.2(GA) H26.2(GA) H27.2(GA) H28.2(GA) H29.2(GA) H30.2(GA) H31.2(GA) H32.2(GA) H33.2(GA) H34.2(GA) H35.2(GA) H36.2(GA) H37.2(GA) H38.2(GA) H39.2(GA) H40.2(GA) H41.2(GA) H42.2(GA) H43.2(GA) H44.2(GA) H45.2(GA) H46.2(GA) H47.2(GA) H48.2(GA) H49.2(GA) H50.2(GA) H51.2(GA) H52.2(GA) H53.2(GA) H54.2(GA) H55.2(GA) H56.2(GA) H57.2(GA) H58.2(GA) H59.2(GA) ; also sheet 1
LE: IC1.4(LE) IC2.4(LE) IC3.4(LE) IC4.4(LE) IC5.4(LE) IC6.4(LE) IC7.4(LE) IC8.4(LE) IC9.4(LE) IC10.4(LE) IC11.4(LE) IC12.4(LE) ; also sheet 1
MB: M0.6(BA) M1.6(BA) M2.6(BA) M3.6(BA) M4.6(BA) M5.6(BA) M6.6(BA) M7.6(BA) M8.6(BA) M9.6(BA) M10.6(BA) M11.6(BA) M12.6(BA) M13.6(BA) M14.6(BA) M15.6(BA) M16.6(BA) M17.6(BA) M18.6(BA) M19.6(BA) M20.6(BA) M21.6(BA) M22.6(BA) M23.6(BA) M24.6(BA) M25.6(BA) M26.6(BA) M27.6(BA) M28.6(BA) M29.6(BA) M30.6(BA) M31.6(BA) M32.6(BA) M33.6(BA) M34.6(BA) M35.6(BA) M36.6(BA) M37.6(BA) M38.6(BA) M39.6(BA) M40.6(BA) M41.6(BA) M42.6(BA) M43.6(BA) M44.6(BA) M45.6(BA) M46.6(BA) M47.6(BA) M48.6(BA) M49.6(BA) M50.6(BA) M51.6(BA) M52.6(BA) M53.6(BA) M54.6(BA) M55.6(BA) M56.6(BA) M57.6(BA) M58.6(BA) M59.6(BA) ; also sheet 1
MG: M0.2(GA) M1.2(GA) M2.2(GA) M3.2(GA) M4.2(GA) M5.2(GA) M6.2(GA) M7.2(GA) M8.2(GA) M9.2(GA) M10.2(GA) M11.2(GA) M12.2(GA) M13.2(GA) M14.2(GA) M15.2(GA) M16.2(GA) M17.2(GA) M18.2(GA) M19.2(GA) M20.2(GA) M21.2(GA) M22.2(GA) M23.2(GA) M24.2(GA) M25.2(GA) M26.2(GA) M27.2(GA) M28.2(GA) M29.2(GA) M30.2(GA) M31.2(GA) M32.2(GA) M33.2(GA) M34.2(GA) M35.2(GA) M36.2(GA) M37.2(GA) M38.2(GA) M39.2(GA) M40.2(GA) M41.2(GA) M42.2(GA) M43.2(GA) M44.2(GA) M45.2(GA) M46.2(GA) M47.2(GA) M48.2(GA) M49.2(GA) M50.2(GA) M51.2(GA) M52.2(GA) M53.2(GA) M54.2(GA) M55.2(GA) M56.2(GA) M57.2(GA) M58.2(GA) M59.2(GA) ; also sheet 1
MR: M0.4(RA) M1.4(RA) M2.4(RA) M3.4(RA) M4.4(RA) M5.4(RA) M6.4(RA) M7.4(RA) M8.4(RA) M9.4(RA) M10.4(RA) M11.4(RA) M12.4(RA) M13.4(RA) M14.4(RA) M15.4(RA) M16.4(RA) M17.4(RA) M18.4(RA) M19.4(RA) M20.4(RA) M21.4(RA) M22.4(RA) M23.4(RA) M24.4(RA) M25.4(RA) M26.4(RA) M27.4(RA) M28.4(RA) M29.4(RA) M30.4(RA) M31.4(RA) M32.4(RA) M33.4(RA) M34.4(RA) M35.4(RA) M36.4(RA) M37.4(RA) M38.4(RA) M39.4(RA) M40.4(RA) M41.4(RA) M42.4(RA) M43.4(RA) M44.4(RA) M45.4(RA) M46.4(RA) M47.4(RA) M48.4(RA) M49.4(RA) M50.4(RA) M51.4(RA) M52.4(RA) M53.4(RA) M54.4(RA) M55.4(RA) M56.4(RA) M57.4(RA) M58.4(RA) M59.4(RA) ; also sheet 1
N$4: IC1.13(OUT8) M2.1(GC) M2.3(RC) M2.5(BC)
N$6: IC1.12(OUT7) S4.1(GC) S4.3(RC) S4.5(BC)
N$7: IC1.11(OUT6) M4.1(GC) M4.3(RC) M4.5(BC)
N$8: H4.1(GC) H4.3(RC) H4.5(BC) IC1.10(OUT5)
N$9: H3.1(GC) H3.3(RC) H3.5(BC) IC1.9(OUT4)
N$10: IC1.8(OUT3) M3.1(GC) M3.3(RC) M3.5(BC)
N$12: IC1.7(OUT2) S3.1(GC) S3.3(RC) S3.5(BC)
N$15: H2.1(GC) H2.3(RC) H2.5(BC) IC1.6(OUT1)
N$16: IC1.20(OUT15) S0.1(GC) S0.3(RC) S0.5(BC)
N$17: IC1.19(OUT14) M0.1(GC) M0.3(RC) M0.5(BC)
N$18: H0.1(GC) H0.3(RC) H0.5(BC) IC1.18(OUT13)
N$19: IC1.17(OUT12) S1.1(GC) S1.3(RC) S1.5(BC)
N$20: IC1.16(OUT11) M1.1(GC) M1.3(RC) M1.5(BC)
N$21: IC1.23(R-EXT) R2.2
N$22: IC1.14(OUT9) S2.1(GC) S2.3(RC) S2.5(BC)
N$23: IC2.13(OUT8) M7.1(GC) M7.3(RC) M7.5(BC)
N$24: IC2.12(OUT7) S9.1(GC) S9.3(RC) S9.5(BC)
N$25: IC2.11(OUT6) M9.1(GC) M9.3(RC) M9.5(BC)
N$26: H9.1(GC) H9.3(RC) H9.5(BC) IC2.10(OUT5)
N$27: H8.1(GC) H8.3(RC) H8.5(BC) IC2.9(OUT4)
N$28: IC2.8(OUT3) M8.1(GC) M8.3(RC) M8.5(BC)
N$29: IC2.7(OUT2) S8.1(GC) S8.3(RC) S8.5(BC)
N$30: H7.1(GC) H7.3(RC) H7.5(BC) IC2.6(OUT1)
N$31: IC2.20(OUT15) S5.1(GC) S5.3(RC) S5.5(BC)
N$32: IC2.19(OUT14) M5.1(GC) M5.3(RC) M5.5(BC)
N$33: H5.1(GC) H5.3(RC) H5.5(BC) IC2.18(OUT13)
N$34: IC2.17(OUT12) S6.1(GC) S6.3(RC) S6.5(BC)
N$36: IC2.16(OUT11) M6.1(GC) M6.3(RC) M6.5(BC)
N$37: IC2.14(OUT9) S7.1(GC) S7.3(RC) S7.5(BC)
N$38: IC2.23(R-EXT) R3.2
N$39: IC3.13(OUT8) M12.1(GC) M12.3(RC) M12.5(BC)
N$40: IC3.12(OUT7) S14.1(GC) S14.3(RC) S14.5(BC)
N$41: IC3.11(OUT6) M14.1(GC) M14.3(RC) M14.5(BC)
N$42: H14.1(GC) H14.3(RC) H14.5(BC) IC3.10(OUT5)
N$43: H13.1(GC) H13.3(RC) H13.5(BC) IC3.9(OUT4)
N$44: IC3.8(OUT3) M13.1(GC) M13.3(RC) M13.5(BC)
N$45: IC3.7(OUT2) S13.1(GC) S13.3(RC) S13.5(BC)
N$46: H12.1(GC) H12.3(RC) H12.5(BC) IC3.6(OUT1)
N$47: IC3.20(OUT15) S10.1(GC) S10.3(RC) S10.5(BC)
N$48: IC3.19(OUT14) M10.1(GC) M10.3(RC) M10.5(BC)
N$49: H10.1(GC) H10.3(RC) H10.5(BC) IC3.18(OUT13)
N$50: IC3.17(OUT12) S11.1(GC) S11.3(RC) S11.5(BC)
N$51: IC3.16(OUT11) M11.1(GC) M11.3(RC) M11.5(BC)
N$52: IC3.14(OUT9) S12.1(GC) S12.3(RC) S12.5(BC)
N$53: IC3.23(R-EXT) R4.2
N$54: IC4.13(OUT8) M17.1(GC) M17.3(RC) M17.5(BC)
N$55: IC4.12(OUT7) S19.1(GC) S19.3(RC) S19.5(BC)
N$56: IC4.11(OUT6) M19.1(GC) M19.3(RC) M19.5(BC)
N$57: H19.1(GC) H19.3(RC) H19.5(BC) IC4.10(OUT5)
N$58: H18.1(GC) H18.3(RC) H18.5(BC) IC4.9(OUT4)
N$59: IC4.8(OUT3) M18.1(GC) M18.3(RC) M18.5(BC)
N$60: IC4.7(OUT2) S18.1(GC) S18.3(RC) S18.5(BC)
N$61: H17.1(GC) H17.3(RC) H17.5(BC) IC4.6(OUT1)
N$62: IC4.20(OUT15) S15.1(GC) S15.3(RC) S15.5(BC)
N$63: IC4.19(OUT14) M15.1(GC) M15.3(RC) M15.5(BC)
N$64: H15.1(GC) H15.3(RC) H15.5(BC) IC4.18(OUT13)
N$65: IC4.17(OUT12) S16.1(GC) S16.3(RC) S16.5(BC)
N$66: IC4.16(OUT11) M16.1(GC) M16.3(RC) M16.5(BC)
N$67: IC4.14(OUT9) S17.1(GC) S17.3(RC) S17.5(BC)
N$68: IC4.23(R-EXT) R5.2
N$69: IC5.13(OUT8) M22.1(GC) M22.3(RC) M22.5(BC)
N$70: IC5.12(OUT7) S24.1(GC) S24.3(RC) S24.5(BC)
N$71: IC5.11(OUT6) M24.1(GC) M24.3(RC) M24.5(BC)
N$72: H24.1(GC) H24.3(RC) H24.5(BC) IC5.10(OUT5)
N$73: H23.1(GC) H23.3(RC) H23.5(BC) IC5.9(OUT4)
N$74: IC5.8(OUT3) M23.1(GC) M23.3(RC) M23.5(BC)
N$75: IC5.7(OUT2) S23.1(GC) S23.3(RC) S23.5(BC)
N$76: H22.1(GC) H22.3(RC) H22.5(BC) IC5.6(OUT1)
N$77: IC5.20(OUT15) S20.1(GC) S20.3(RC) S20.5(BC)
N$78: IC5.19(OUT14) M20.1(GC) M20.3(RC) M20.5(BC)
N$79: H20.1(GC) H20.3(RC) H20.5(BC) IC5.18(OUT13)
N$80: IC5.17(OUT12) S21.1(GC) S21.3(RC) S21.5(BC)
N$81: IC5.16(OUT11) M21.1(GC) M21.3(RC) M21.5(BC)
N$82: IC5.14(OUT9) S22.1(GC) S22.3(RC) S22.5(BC)
N$83: IC5.23(R-EXT) R6.2
N$84: IC6.13(OUT8) M27.1(GC) M27.3(RC) M27.5(BC)
N$85: IC6.12(OUT7) S29.1(GC) S29.3(RC) S29.5(BC)
N$86: IC6.11(OUT6) M29.1(GC) M29.3(RC) M29.5(BC)
N$87: H29.1(GC) H29.3(RC) H29.5(BC) IC6.10(OUT5)
N$88: H28.1(GC) H28.3(RC) H28.5(BC) IC6.9(OUT4)
N$89: IC6.8(OUT3) M28.1(GC) M28.3(RC) M28.5(BC)
N$90: IC6.7(OUT2) S28.1(GC) S28.3(RC) S28.5(BC)
N$91: H27.1(GC) H27.3(RC) H27.5(BC) IC6.6(OUT1)
N$92: IC6.20(OUT15) S25.1(GC) S25.3(RC) S25.5(BC)
N$93: IC6.19(OUT14) M25.1(GC) M25.3(RC) M25.5(BC)
N$94: H25.1(GC) H25.3(RC) H25.5(BC) IC6.18(OUT13)
N$95: IC6.17(OUT12) S26.1(GC) S26.3(RC) S26.5(BC)
N$96: IC6.16(OUT11) M26.1(GC) M26.3(RC) M26.5(BC)
N$97: IC6.14(OUT9) S27.1(GC) S27.3(RC) S27.5(BC)
N$98: IC6.23(R-EXT) R7.2
N$99: IC7.13(OUT8) M32.1(GC) M32.3(RC) M32.5(BC)
N$100: IC7.12(OUT7) S34.1(GC) S34.3(RC) S34.5(BC)
N$101: IC7.11(OUT6) M34.1(GC) M34.3(RC) M34.5(BC)
N$102: H34.1(GC) H34.3(RC) H34.5(BC) IC7.10(OUT5)
N$103: H33.1(GC) H33.3(RC) H33.5(BC) IC7.9(OUT4)
N$104: IC7.8(OUT3) M33.1(GC) M33.3(RC) M33.5(BC)
N$105: IC7.7(OUT2) S33.1(GC) S33.3(RC) S33.5(BC)
N$106: H32.1(GC) H32.3(RC) H32.5(BC) IC7.6(OUT1)
N$107: IC7.20(OUT15) S30.1(GC) S30.3(RC) S30.5(BC)
N$108: IC7.19(OUT14) M30.1(GC) M30.3(RC) M30.5(BC)
N$109: H30.1(GC) H30.3(RC) H30.5(BC) IC7.18(OUT13)
N$110: IC7.17(OUT12) S31.1(GC) S31.3(RC) S31.5(BC)
N$111: IC7.16(OUT11) M31.1(GC) M31.3(RC) M31.5(BC)
N$112: IC7.14(OUT9) S32.1(GC) S32.3(RC) S32.5(BC)
N$113: IC7.23(R-EXT) R8.2
N$114: IC8.13(OUT8) M37.1(GC) M37.3(RC) M37.5(BC)
N$115: IC8.12(OUT7) S39.1(GC) S39.3(RC) S39.5(BC)
N$116: IC8.11(OUT6) M39.1(GC) M39.3(RC) M39.5(BC)
N$117: H39.1(GC) H39.3(RC) H39.5(BC) IC8.10(OUT5)
N$118: H38.1(GC) H38.3(RC) H38.5(BC) IC8.9(OUT4)
N$119: IC8.8(OUT3) M38.1(GC) M38.3(RC) M38.5(BC)
N$120: IC8.7(OUT2) S38.1(GC) S38.3(RC) S38.5(BC)
N$121: H37.1(GC) H37.3(RC) H37.5(BC) IC8.6(OUT1)
N$122: IC8.20(OUT15) S35.1(GC) S35.3(RC) S35.5(BC)
N$123: IC8.19(OUT14) M35.1(GC) M35.3(RC) M35.5(BC)
N$124: H35.1(GC) H35.3(RC) H35.5(BC) IC8.18(OUT13)
N$125: IC8.17(OUT12) S36.1(GC) S36.3(RC) S36.5(BC)
N$126: IC8.16(OUT11) M36.1(GC) M36.3(RC) M36.5(BC)
N$127: IC8.14(OUT9) S37.1(GC) S37.3(RC) S37.5(BC)
N$128: IC8.23(R-EXT) R9.2
N$129: IC9.13(OUT8) M42.1(GC) M42.3(RC) M42.5(BC)
N$130: IC9.12(OUT7) S44.1(GC) S44.3(RC) S44.5(BC)
N$131: IC9.11(OUT6) M44.1(GC) M44.3(RC) M44.5(BC)
N$132: H44.1(GC) H44.3(RC) H44.5(BC) IC9.10(OUT5)
N$133: H43.1(GC) H43.3(RC) H43.5(BC) IC9.9(OUT4)
N$134: IC9.8(OUT3) M43.1(GC) M43.3(RC) M43.5(BC)
N$135: IC9.7(OUT2) S43.1(GC) S43.3(RC) S43.5(BC)
N$136: H42.1(GC) H42.3(RC) H42.5(BC) IC9.6(OUT1)
N$137: IC9.20(OUT15) S40.1(GC) S40.3(RC) S40.5(BC)
N$138: IC9.19(OUT14) M40.1(GC) M40.3(RC) M40.5(BC)
N$139: H40.1(GC) H40.3(RC) H40.5(BC) IC9.18(OUT13)
N$140: IC9.17(OUT12) S41.1(GC) S41.3(RC) S41.5(BC)
N$141: IC9.16(OUT11) M41.1(GC) M41.3(RC) M41.5(BC)
N$142: IC9.14(OUT9) S42.1(GC) S42.3(RC) S42.5(BC)
N$143: IC9.23(R-EXT) R10.2
N$144: IC10.13(OUT8) M47.1(GC) M47.3(RC) M47.5(BC)
N$145: IC10.12(OUT7) S49.1(GC) S49.3(RC) S49.5(BC)
N$146: IC10.11(OUT6) M49.1(GC) M49.3(RC) M49.5(BC)
N$147: H49.1(GC) H49.3(RC) H49.5(BC) IC10.10(OUT5)
N$148: H48.1(GC) H48.3(RC) H48.5(BC) IC10.9(OUT4)
N$149: IC10.8(OUT3) M48.1(GC) M48.3(RC) M48.5(BC)
N$150: IC10.7(OUT2) S48.1(GC) S48.3(RC) S48.5(BC)
N$151: H47.1(GC) H47.3(RC) H47.5(BC) IC10.6(OUT1)
N$152: IC10.20(OUT15) S45.1(GC) S45.3(RC) S45.5(BC)
N$153: IC10.19(OUT14) M45.1(GC) M45.3(RC) M45.5(BC)
N$154: H45.1(GC) H45.3(RC) H45.5(BC) IC10.18(OUT13)
N$155: IC10.17(OUT12) S46.1(GC) S46.3(RC) S46.5(BC)
N$156: IC10.16(OUT11) M46.1(GC) M46.3(RC) M46.5(BC)
N$157: IC10.14(OUT9) S47.1(GC) S47.3(RC) S47.5(BC)
N$158: IC10.23(R-EXT) R11.2
N$159: IC11.13(OUT8) M52.1(GC) M52.3(RC) M52.5(BC)
N$160: IC11.12(OUT7) S54.1(GC) S54.3(RC) S54.5(BC)
N$161: IC11.11(OUT6) M54.1(GC) M54.3(RC) M54.5(BC)
N$162: H54.1(GC) H54.3(RC) H54.5(BC) IC11.10(OUT5)
N$163: H53.1(GC) H53.3(RC) H53.5(BC) IC11.9(OUT4)
N$164: IC11.8(OUT3) M53.1(GC) M53.3(RC) M53.5(BC)
N$165: IC11.7(OUT2) S53.1(GC) S53.3(RC) S53.5(BC)
N$166: H52.1(GC) H52.3(RC) H52.5(BC) IC11.6(OUT1)
N$167: IC11.20(OUT15) S50.1(GC) S50.3(RC) S50.5(BC)
N$168: IC11.19(OUT14) M50.1(GC) M50.3(RC) M50.5(BC)
N$169: H50.1(GC) H50.3(RC) H50.5(BC) IC11.18(OUT13)
N$170: IC11.17(OUT12) S51.1(GC) S51.3(RC) S51.5(BC)
N$171: IC11.16(OUT11) M51.1(GC) M51.3(RC) M51.5(BC)
N$172: IC11.14(OUT9) S52.1(GC) S52.3(RC) S52.5(BC)
N$173: IC11.23(R-EXT) R12.2
N$174: IC12.13(OUT8) M57.1(GC) M57.3(RC) M57.5(BC)
N$175: IC12.12(OUT7) S59.1(GC) S59.3(RC) S59.5(BC)
N$176: IC12.11(OUT6) M59.1(GC) M59.3(RC) M59.5(BC)
N$177: H59.1(GC) H59.3(RC) H59.5(BC) IC12.10(OUT5)
N$178: H58.1(GC) H58.3(RC) H58.5(BC) IC12.9(OUT4)
N$179: IC12.8(OUT3) M58.1(GC) M58.3(RC) M58.5(BC)
N$180: IC12.7(OUT2) S58.1(GC) S58.3(RC) S58.5(BC)
N$181: H57.1(GC) H57.3(RC) H57.5(BC) IC12.6(OUT1)
N$182: IC12.20(OUT15) S55.1(GC) S55.3(RC) S55.5(BC)
N$183: IC12.19(OUT14) M55.1(GC) M55.3(RC) M55.5(BC)
N$184: H55.1(GC) H55.3(RC) H55.5(BC) IC12.18(OUT13)
N$185: IC12.17(OUT12) S56.1(GC) S56.3(RC) S56.5(BC)
N$186: IC12.16(OUT11) M56.1(GC) M56.3(RC) M56.5(BC)
N$187: IC12.14(OUT9) S57.1(GC) S57.3(RC) S57.5(BC)
N$188: IC12.23(R-EXT) R13.2
N$204: H0.4(RA) H1.4(RA) H2.4(RA) H3.4(RA) H4.4(RA) H5.4(RA) H6.4(RA) H7.4(RA) H8.4(RA) H9.4(RA) H10.4(RA) H11.4(RA) H12.4(RA) H13.4(RA) H14.4(RA) H15.4(RA) H16.4(RA) H17.4(RA) H18.4(RA) H19.4(RA) H20.4(RA) H21.4(RA) H22.4(RA) H23.4(RA) H24.4(RA) H25.4(RA) H26.4(RA) H27.4(RA) H28.4(RA) H29.4(RA) H30.4(RA) H31.4(RA) H32.4(RA) H33.4(RA) H34.4(RA) H35.4(RA) H36.4(RA) H37.4(RA) H38.4(RA) H39.4(RA) H40.4(RA) H41.4(RA) H42.4(RA) H43.4(RA) H44.4(RA) H45.4(RA) H46.4(RA) H47.4(RA) H48.4(RA) H49.4(RA) H50.4(RA) H51.4(RA) H52.4(RA) H53.4(RA) H54.4(RA) H55.4(RA) H56.4(RA) H57.4(RA) H58.4(RA) H59.4(RA) ; also sheet 1
OE: IC1.21(OE) IC2.21(OE) IC3.21(OE) IC4.21(OE) IC5.21(OE) IC6.21(OE) IC7.21(OE) IC8.21(OE) IC9.21(OE) IC10.21(OE) IC11.21(OE) IC12.21(OE) ; also sheet 1
S1: IC1.22(SDO) IC2.2(SDI)
S2: IC2.22(SDO) IC3.2(SDI)
S3: IC3.22(SDO) IC4.2(SDI)
S4: IC4.22(SDO) IC5.2(SDI)
S5: IC5.22(SDO) IC6.2(SDI)
S6: IC6.22(SDO) IC7.2(SDI)
S7: IC7.22(SDO) IC8.2(SDI)
S8: IC8.22(SDO) IC9.2(SDI)
S9: IC9.22(SDO) IC10.2(SDI)
S10: IC10.22(SDO) IC11.2(SDI)
S11: IC11.22(SDO) IC12.2(SDI)
S12: IC12.22(SDO)
SB: S0.6(BA) S1.6(BA) S2.6(BA) S3.6(BA) S4.6(BA) S5.6(BA) S6.6(BA) S7.6(BA) S8.6(BA) S9.6(BA) S10.6(BA) S11.6(BA) S12.6(BA) S13.6(BA) S14.6(BA) S15.6(BA) S16.6(BA) S17.6(BA) S18.6(BA) S19.6(BA) S20.6(BA) S21.6(BA) S22.6(BA) S23.6(BA) S24.6(BA) S25.6(BA) S26.6(BA) S27.6(BA) S28.6(BA) S29.6(BA) S30.6(BA) S31.6(BA) S32.6(BA) S33.6(BA) S34.6(BA) S35.6(BA) S36.6(BA) S37.6(BA) S38.6(BA) S39.6(BA) S40.6(BA) S41.6(BA) S42.6(BA) S43.6(BA) S44.6(BA) S45.6(BA) S46.6(BA) S47.6(BA) S48.6(BA) S49.6(BA) S50.6(BA) S51.6(BA) S52.6(BA) S53.6(BA) S54.6(BA) S55.6(BA) S56.6(BA) S57.6(BA) S58.6(BA) S59.6(BA) ; also sheet 1
SG: S0.2(GA) S1.2(GA) S2.2(GA) S3.2(GA) S4.2(GA) S5.2(GA) S6.2(GA) S7.2(GA) S8.2(GA) S9.2(GA) S10.2(GA) S11.2(GA) S12.2(GA) S13.2(GA) S14.2(GA) S15.2(GA) S16.2(GA) S17.2(GA) S18.2(GA) S19.2(GA) S20.2(GA) S21.2(GA) S22.2(GA) S23.2(GA) S24.2(GA) S25.2(GA) S26.2(GA) S27.2(GA) S28.2(GA) S29.2(GA) S30.2(GA) S31.2(GA) S32.2(GA) S33.2(GA) S34.2(GA) S35.2(GA) S36.2(GA) S37.2(GA) S38.2(GA) S39.2(GA) S40.2(GA) S41.2(GA) S42.2(GA) S43.2(GA) S44.2(GA) S45.2(GA) S46.2(GA) S47.2(GA) S48.2(GA) S49.2(GA) S50.2(GA) S51.2(GA) S52.2(GA) S53.2(GA) S54.2(GA) S55.2(GA) S56.2(GA) S57.2(GA) S58.2(GA) S59.2(GA) ; also sheet 1
SIN: IC1.2(SDI) ; also sheet 1
SR: S0.4(RA) S1.4(RA) S2.4(RA) S3.4(RA) S4.4(RA) S5.4(RA) S6.4(RA) S7.4(RA) S8.4(RA) S9.4(RA) S10.4(RA) S11.4(RA) S12.4(RA) S13.4(RA) S14.4(RA) S15.4(RA) S16.4(RA) S17.4(RA) S18.4(RA) S19.4(RA) S20.4(RA) S21.4(RA) S22.4(RA) S23.4(RA) S24.4(RA) S25.4(RA) S26.4(RA) S27.4(RA) S28.4(RA) S29.4(RA) S30.4(RA) S31.4(RA) S32.4(RA) S33.4(RA) S34.4(RA) S35.4(RA) S36.4(RA) S37.4(RA) S38.4(RA) S39.4(RA) S40.4(RA) S41.4(RA) S42.4(RA) S43.4(RA) S44.4(RA) S45.4(RA) S46.4(RA) S47.4(RA) S48.4(RA) S49.4(RA) S50.4(RA) S51.4(RA) S52.4(RA) S53.4(RA) S54.4(RA) S55.4(RA) S56.4(RA) S57.4(RA) S58.4(RA) S59.4(RA) ; also sheet 1
Unconnected: IC1.5(OUT0) IC2.5(OUT0) IC3.5(OUT0) IC4.5(OUT0) IC5.5(OUT0) IC6.5(OUT0) IC7.5(OUT0) IC8.5(OUT0) IC9.5(OUT0) IC10.5(OUT0) IC11.5(OUT0) IC12.5(OUT0)

## Library data of the parts
ARDUINO = arduino_Uno_Rev3-02-TH:SMARTPRJ_ATMEGA328P-: MICROCONTROLLER 4 Kbytes FLASH 128 bytes SRAM 256 bytes EEPROM UART 6-channel 10 bit ADC
BAT1 = SparkFun:BATTERY: Battery Holders Various common sizes : AA, AAA, 20mm coin cell and 12mm coin cell.
C1_OSC C2_OSC = SparkFun:CAP: Capacitor Standard 0603 ceramic capacitor, and 0.1" leaded capacitor.
C3_MCU C3_MCU1 C_DS = rcl:C-EU: CAPACITOR, European symbol
D1 D2 IC1-IC12 LINE_IC = moje:TLC5925
D1_RESET = diode:1N4148: DIODE high speed (Philips)
DHT11 = SparkFun:M04: Header 4 Standard 4-pin 0.1" header. Use with straight break away headers (SKU : PRT-00116), right angle break away headers (PRT-00553), swiss pins (PRT-00743), machine pins (PRT-00117), and female headers (PRT-00115). Molex polarized connector foot print use with SKU : PRT-08231 with associated crimp pins and housings. 1MM SMD Version SKU: PRT-10208
DIS1 DIS2 = display-hp:HD-K121: LED DISPLAY 2 x 1 character 7 segment, decimal points right; OC_FARNELL: unknown; OC_NEWARK: unknown
H0 H1-H59 M0 M1-M59 S0 S1-S59 = moje:PLCC6RGB
J1 = SparkFun:AVR_SPI_PRG_6: AVR ISP 6 Pin This is the reduced ISP connector for AVR programming. Common on Arduino. This footprint will take up less PCB space and can be used with a 10-pin to 6-pin adapter such as SKU: BOB-08508
JP1 = SparkFun:JUMPER-3
JP2 = SparkFun:M02: Header 2 Standard 2-pin 0.1" header. Use with straight break away headers (SKU : PRT-00116), right angle break away headers (PRT-00553), swiss pins (PRT-00743), machine pins (PRT-00117), and female headers (PRT-00115). Molex polarized connector foot print use with SKU : PRT-08233 with associated crimp pins and housings.
L1-L9 = SparkFun:MOSFET-PCHANNEL
LED1 LED2 = arduino_Uno_Rev3-02-TH:LED_LED: LED OSRAM: - CHIPLED LG R971, LG N971, LY N971, LG Q971, LY Q971, LO R971, LY R971 LH N974, LH R974 LS Q976, LO Q976, LY Q976 LO Q996 - Hyper CHIPLED LW Q18S LB Q993, LB Q99A, LB R99A - SideLED LS A670, LO A670, LY A670, LG A670, LP A670 LB A673, LV A673, LT A673, LW A673 LH A674 LY A675 LS A676, LA A676, LO A676, LY A676, LW A676 LS A679, LY A679, LG A679 - Hyper Micro SIDELED® LS Y876, LA Y876, LO Y876, LY Y876 LT Y87S - SmartLED LW L88C, LW L88S LB L89C, LB L89S, LG L890 LS L89K, LO L89K, LY L89K LS L896, LA L896, LO L896, LY L896 - TOPLED LS T670, LO T670, LY T670, LG T670, LP T670 LSG T670, LSP T670, LSY T670, LOP T670, LYG T670 LG T671, LOG T671, LSG T671 LB T673, LV T673, LT T673, LW T673 LH T674 LS T676, LA T676, LO T676, LY T676, LB T676, LH T676, LSB T676, LW T676 LB T67C, LV T67C, LT T67C, LS T67K, LO T67K, LY T67K, LW E67C LS E67B, LA E67B, LO E67B, LY E67B, LB E67C, LV E67C, LT E67C LW T67C LS T679, LY T679, LG T679 LS T770, LO T770, LY T770, LG T770, LP T770 LB T773, LV T773, LT T773, LW T773 LH T774 LS E675, LA E675, LY E675, LS T675 LS T776, LA T776, LO T776, LY T776, LB T776 LHGB T686 LT T68C, LB T68C - Hyper Mini TOPLED® LB M676 - Mini TOPLED Santana® LG M470 LS M47K, LO M47K, LY M47K Source: http://www.osram.convergy.de LUXEON: - LUMILED® LXK2-PW12-R00, LXK2-PW12-S00, LXK2-PW14-U00, LXK2-PW14-V00 LXK2-PM12-R00, LXK2-PM12-S00, LXK2-PM14-U00 LXK2-PE12-Q00, LXK2-PE12-R00, LXK2-PE12-S00, LXK2-PE14-T00, LXK2-PE14-U00 LXK2-PB12-K00, LXK2-PB12-L00, LXK2-PB12-M00, LXK2-PB14-N00, LXK2-PB14-P00, LXK2-PB14-Q00 LXK2-PR12-L00, LXK2-PR12-M00, LXK2-PR14-Q00, LXK2-PR14-R00 LXK2-PD12-Q00, LXK2-PD12-R00, LXK2-PD12-S00 LXK2-PH12-R00, LXK2-PH12-S00 LXK2-PL12-P00, LXK2-PL12-Q00, LXK2-PL12-R00 Source: www.luxeon.com KINGBRIGHT: KA-3528ASYC Source: www.kingbright.com
LOG_TR4 = SparkFun2:TRANSISTOR_PNP
OSC = crystal:CRYSTAL: CRYSTAL; OC_FARNELL: unknown; OC_NEWARK: unknown
R2-R13 R_OSC R_RESET RM1-RM13 RM43-RM48 = rcl:R-EU_: RESISTOR, European symbol
RSCL RSDA = arduino_Uno_Rev3-02-TH:SMARTPRJ_R-EU_: RESISTOR, European symbol
RTC = ds1307_pcf8583:DS1307: I2C-Bus CLOCK/CALENDAR
SERIAL_PROG = SparkFun:M06: Header 6 Standard 6-pin 0.1" header. Use with straight break away headers (SKU : PRT-00116), right angle break away headers (PRT-00553), swiss pins (PRT-00743), machine pins (PRT-00117), and female headers (PRT-00115). Molex polarized connector foot print use with SKU : PRT-08094 with associated crimp pins and housings. NOTES ON THE VARIANTS LOCK and LOCK_LONGPADS... This footprint was designed to help hold the alignment of a through-hole component (i.e. 6-pin header) while soldering it into place. You may notice that each hole has been shifted either up or down by 0.005 of an inch from it's more standard position (which is a perfectly straight line). This slight alteration caused the pins (the squares in the middle) to touch the edges of the holes. Because they are alternating, it causes a "brace" to hold the component in place. 0.005 has proven to be the perfect amount of "off-center" position when using our standard breakaway headers. Although looks a little odd when you look at the bare footprint, once you have a header in there, the alteration is very hard to notice. Also, if you push a header all the way into place, it is covered up entirely on the bottom side. This idea of altering the position of holes to aid alignment will be further integrated into the Sparkfun Library for other footprints. It can help hold any component with 3 or more connection pins.
SJ1 = jumper:SJ: SMD solder JUMPER
SW1-SW4 = switch-omron:11-XX
U$1 = SparkFun:USB-MINIB: Mini-USB "B" connector with 5th pin broken out. Created new symbol breaking out 5th "ID" pin in mini/micro USB connector spec. See: http://en.wikipedia.org/wiki/Mini_usb#Cables. Uses same footprint as 4-pin symbol. Also added pins to connect to mounting / shield pads if required (probably not generally needed as signals aren't shielded once they leave the connector).
Y1 = SparkFun:CRYSTAL: Crystals Various standard crystals. Proven footprints. Spark Fun Electronics SKU : COM-00534